# EAGLE design U23_2012 (EAGLE 6.3)
test

## Sheet 1 of 6: VGA
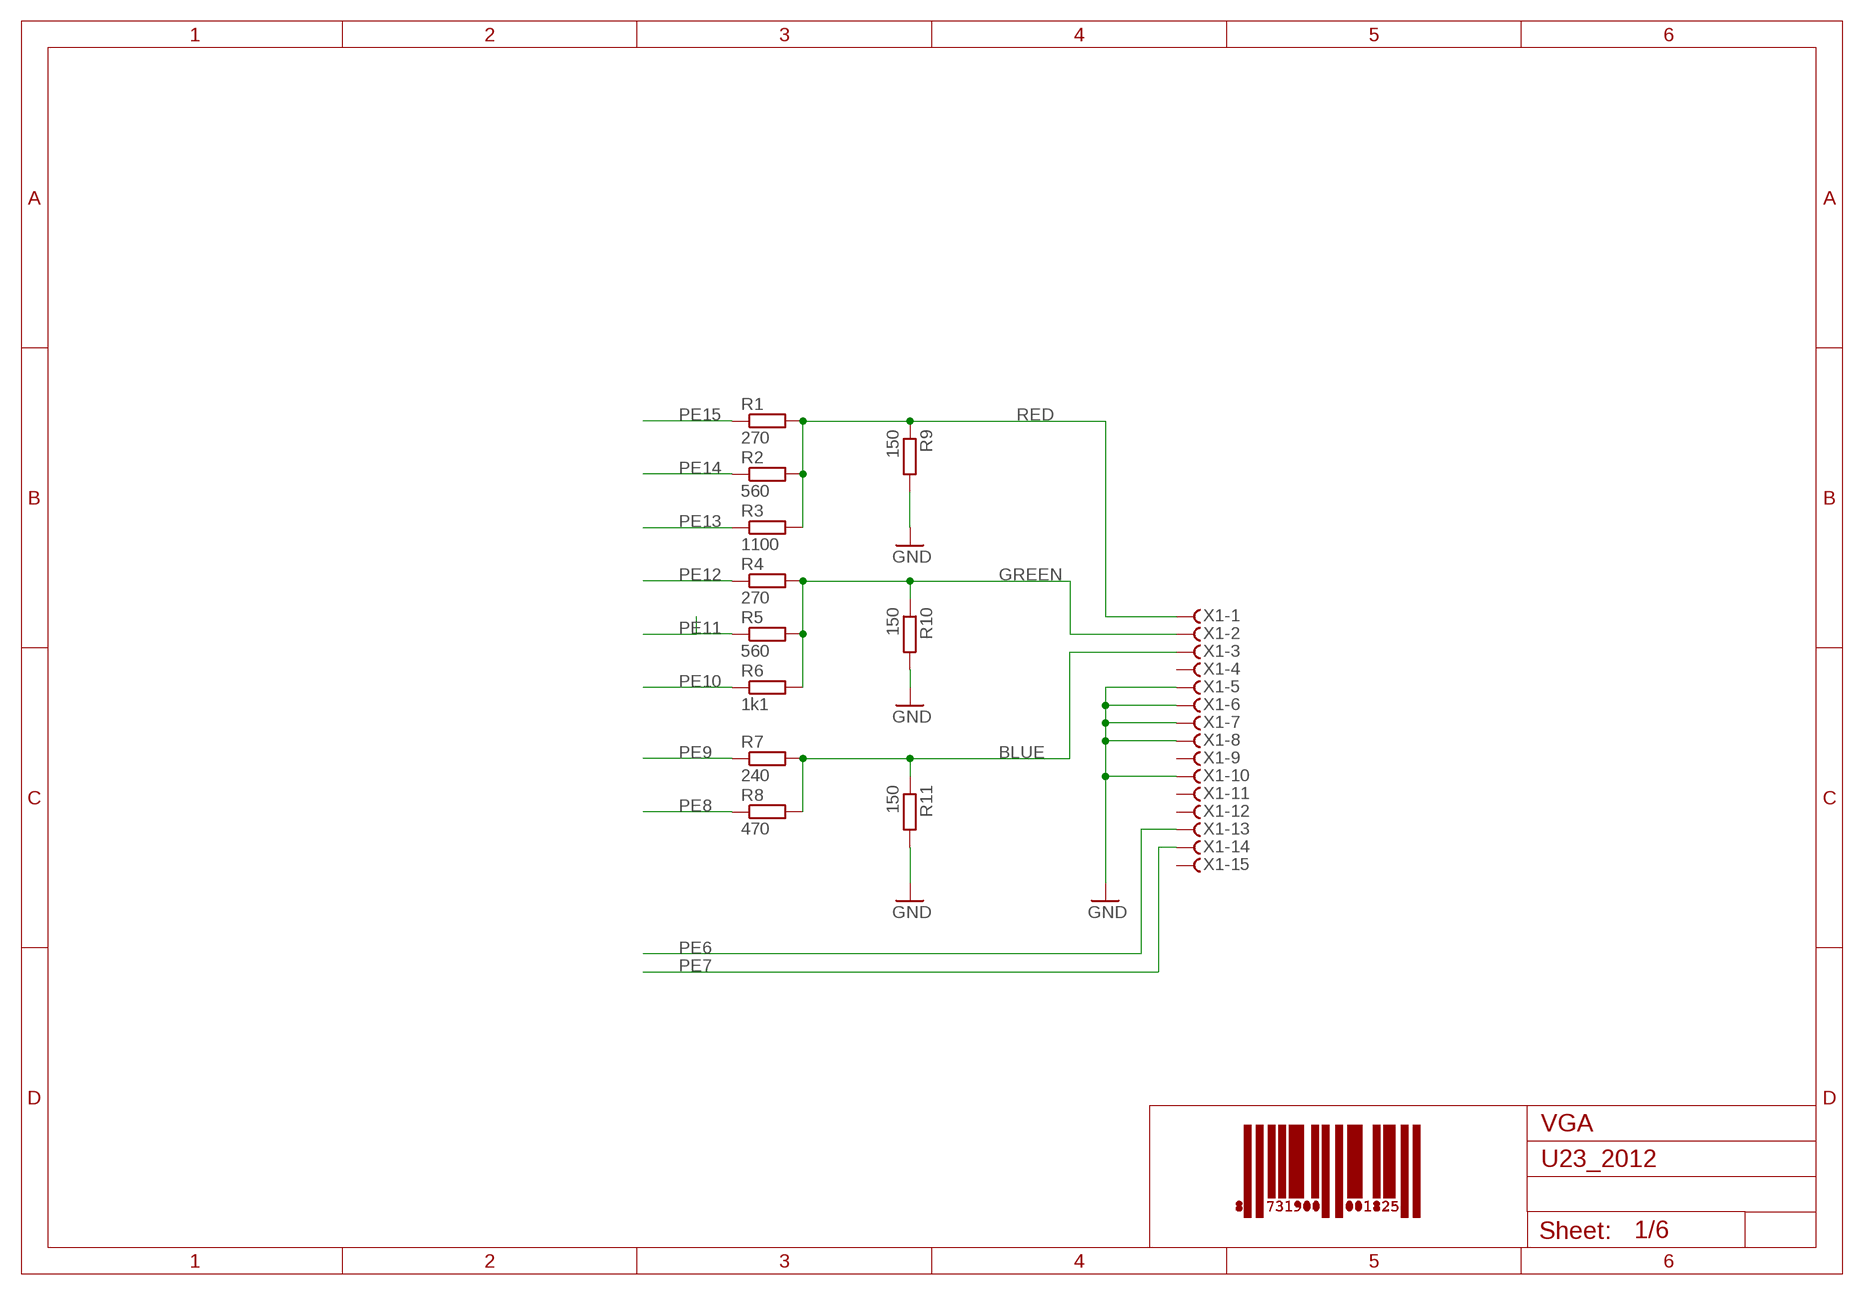
[diagram p0: schematic, sheet 1]

### Parts
R1  270  R-EU_0207/10  [0207/10]
R2  560  R-EU_0207/10  [0207/10]
R3  1100  R-EU_0207/10  [0207/10]
R4  270  R-EU_0207/10  [0207/10]
R5  560  R-EU_0207/10  [0207/10]
R6  1k1  R-EU_0207/10  [0207/10]
R7  240  R-EU_0207/10  [0207/10]
R8  470  R-EU_0207/10  [0207/10]
R9  150  R-EU_0207/10  [0207/10]
R10  150  R-EU_0207/10  [0207/10]
R11  150  R-EU_0207/10  [0207/10]
X1  F15HDHS  [HDF15H]

### Nets
BLUE: R7.2 R8.2 R11.1 X1.3
GND: R9.2 R10.2 R11.2 X1.5 X1.6 X1.7 X1.8 X1.10 ; also sheet 2,3,4,5,6
GREEN: R4.2 R5.2 R6.2 R10.1 X1.2
PE6: X1.13 ; also sheet 2
PE7: X1.14 ; also sheet 2
PE8: R8.1 ; also sheet 2
PE9: R7.1 ; also sheet 2
PE10: R6.1 ; also sheet 2
PE11: R5.1 ; also sheet 2
PE12: R4.1 ; also sheet 2
PE13: R3.1 ; also sheet 2
PE14: R2.1 ; also sheet 2
PE15: R1.1 ; also sheet 2
RED: R1.2 R2.2 R3.2 R9.1 X1.1
Unconnected: X1.4 X1.9 X1.11 X1.12 X1.15

## Sheet 2 of 6: Connector
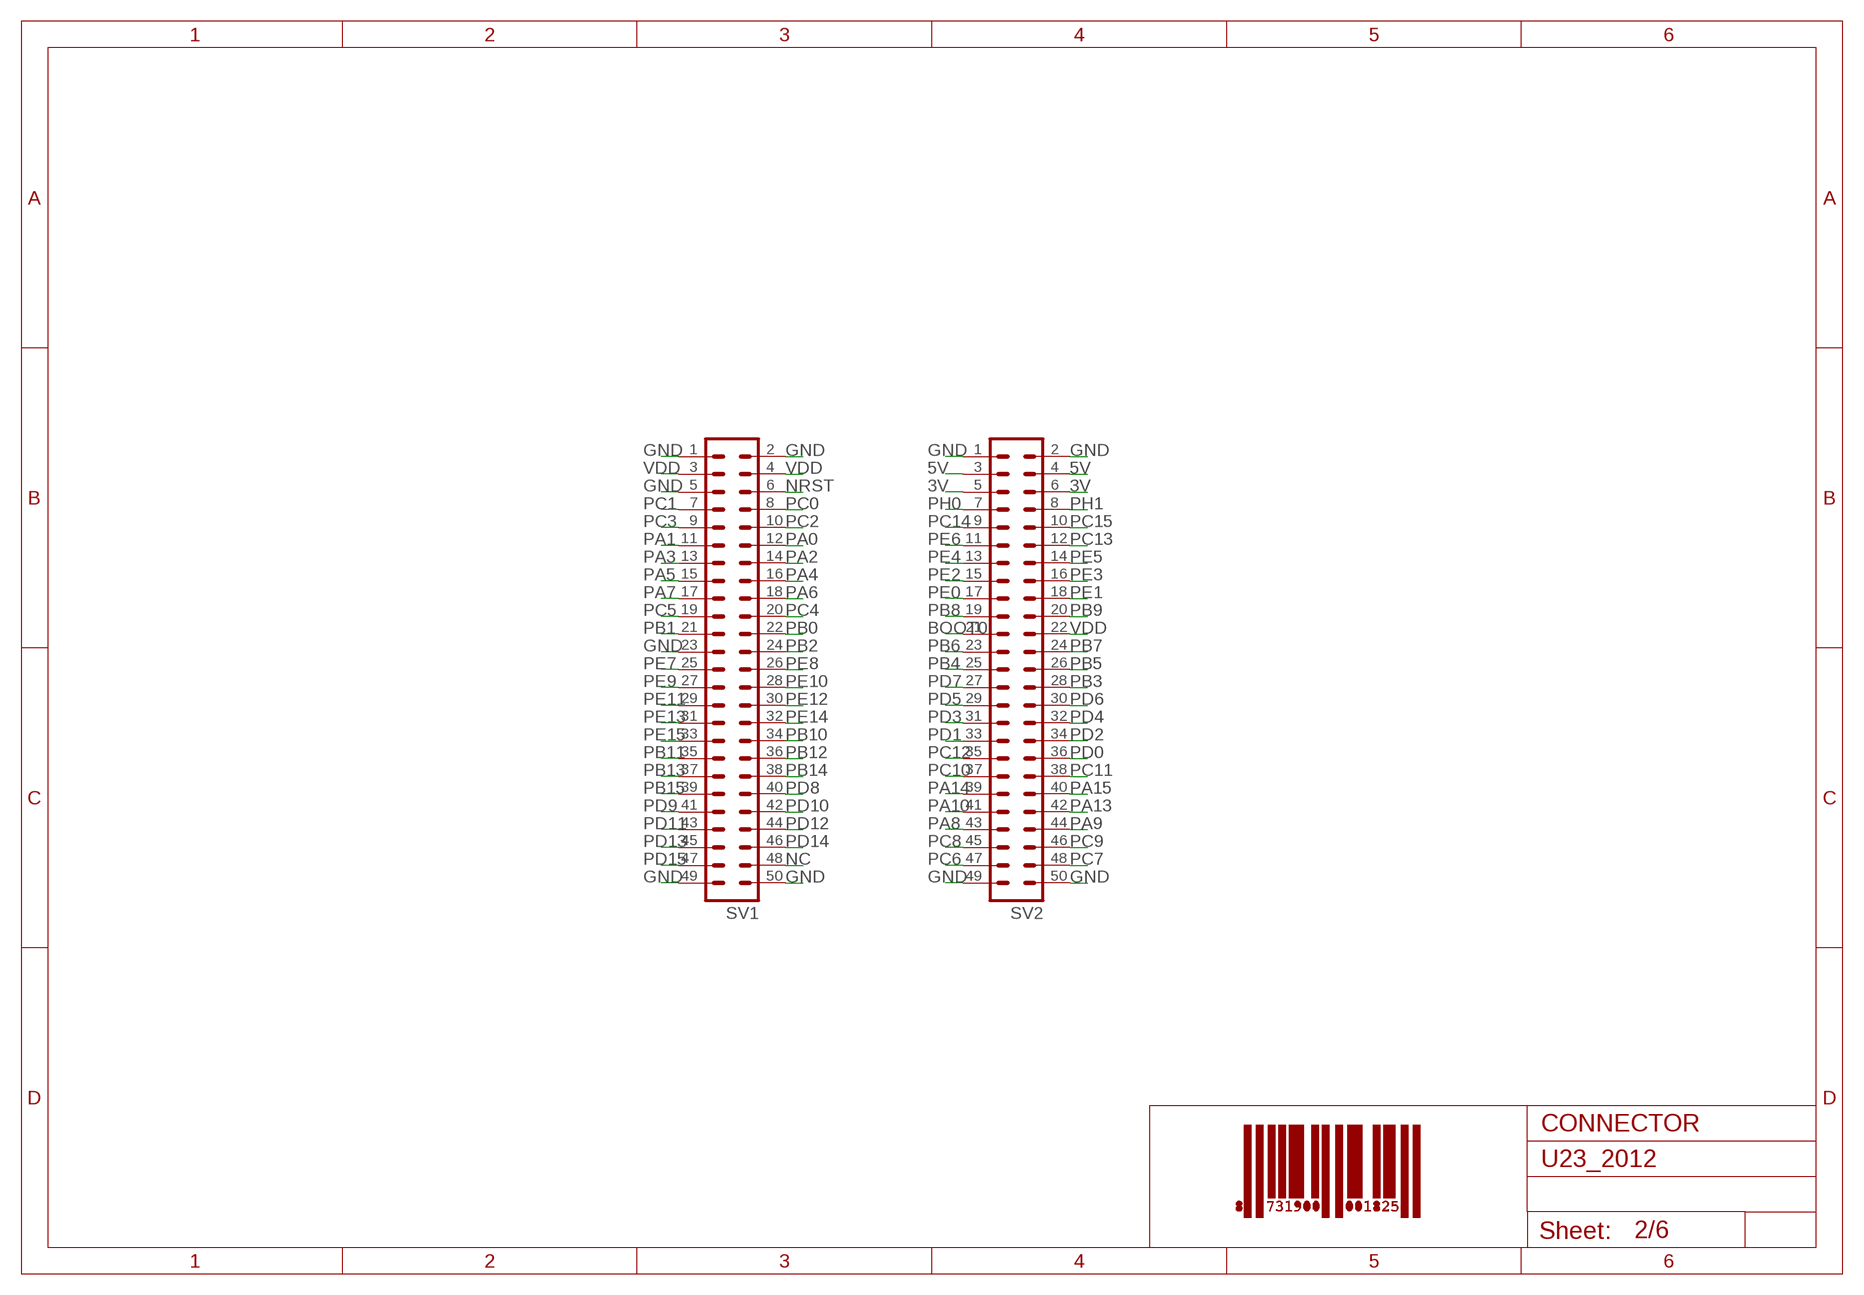
[diagram p1: schematic, sheet 2]

### Parts
SV1  ML50  [ML50]
SV2  ML50  [ML50]

### Nets
3V: SV2.5 SV2.6 ; also sheet 3,4,6
5V: SV2.3 SV2.4 ; also sheet 5,6
BOOT0: SV2.21
GND: SV1.1 SV1.2 SV1.5 SV1.23 SV1.49 SV1.50 SV2.1 SV2.2 SV2.49 SV2.50 ; also sheet 1,3,4,5,6
NC: SV1.48
NRST: SV1.6
PA0: SV1.12
PA1: SV1.11 ; also sheet 3
PA2: SV1.14 ; also sheet 3
PA3: SV1.13
PA4: SV1.16
PA5: SV1.15
PA6: SV1.18
PA7: SV1.17 ; also sheet 3
PA8: SV2.43
PA9: SV2.44
PA10: SV2.41
PA13: SV2.42
PA14: SV2.39
PA15: SV2.40
PB0: SV1.22 ; also sheet 6
PB1: SV1.21 ; also sheet 6
PB2: SV1.24 ; also sheet 4
PB3: SV2.28
PB4: SV2.25 ; also sheet 6
PB5: SV2.26 ; also sheet 6
PB6: SV2.23
PB7: SV2.24 ; also sheet 6
PB8: SV2.19 ; also sheet 6
PB9: SV2.20
PB10: SV1.34
PB11: SV1.35 ; also sheet 3
PB12: SV1.36 ; also sheet 3
PB13: SV1.37 ; also sheet 3
PB14: SV1.38
PB15: SV1.39
PC0: SV1.8
PC1: SV1.7 ; also sheet 3
PC2: SV1.10
PC3: SV1.9
PC4: SV1.20 ; also sheet 3
PC5: SV1.19 ; also sheet 3
PC6: SV2.47
PC7: SV2.48
PC8: SV2.45 ; also sheet 4
PC9: SV2.46 ; also sheet 4
PC10: SV2.37 ; also sheet 4
PC11: SV2.38 ; also sheet 4
PC12: SV2.35 ; also sheet 4
PC13: SV2.12
PC14: SV2.9
PC15: SV2.10
PD0: SV2.36 ; also sheet 5
PD1: SV2.33 ; also sheet 5
PD2: SV2.34 ; also sheet 4
PD3: SV2.31 ; also sheet 5
PD4: SV2.32
PD5: SV2.29 ; also sheet 5
PD6: SV2.30 ; also sheet 5
PD7: SV2.27 ; also sheet 5
PD8: SV1.40 ; also sheet 6
PD9: SV1.41
PD10: SV1.42
PD11: SV1.43
PD12: SV1.44 ; also sheet 6
PD13: SV1.45 ; also sheet 6
PD14: SV1.46 ; also sheet 6
PD15: SV1.47 ; also sheet 6
PE0: SV2.17
PE1: SV2.18
PE2: SV2.15
PE3: SV2.16
PE4: SV2.13
PE5: SV2.14
PE6: SV2.11 ; also sheet 1
PE7: SV1.25 ; also sheet 1
PE8: SV1.26 ; also sheet 1
PE9: SV1.27 ; also sheet 1
PE10: SV1.28 ; also sheet 1
PE11: SV1.29 ; also sheet 1
PE12: SV1.30 ; also sheet 1
PE13: SV1.31 ; also sheet 1
PE14: SV1.32 ; also sheet 1
PE15: SV1.33 ; also sheet 1
PH0: SV2.7
PH1: SV2.8
VDD: SV1.3 SV1.4 SV2.22

## Sheet 3 of 6: Ethernet
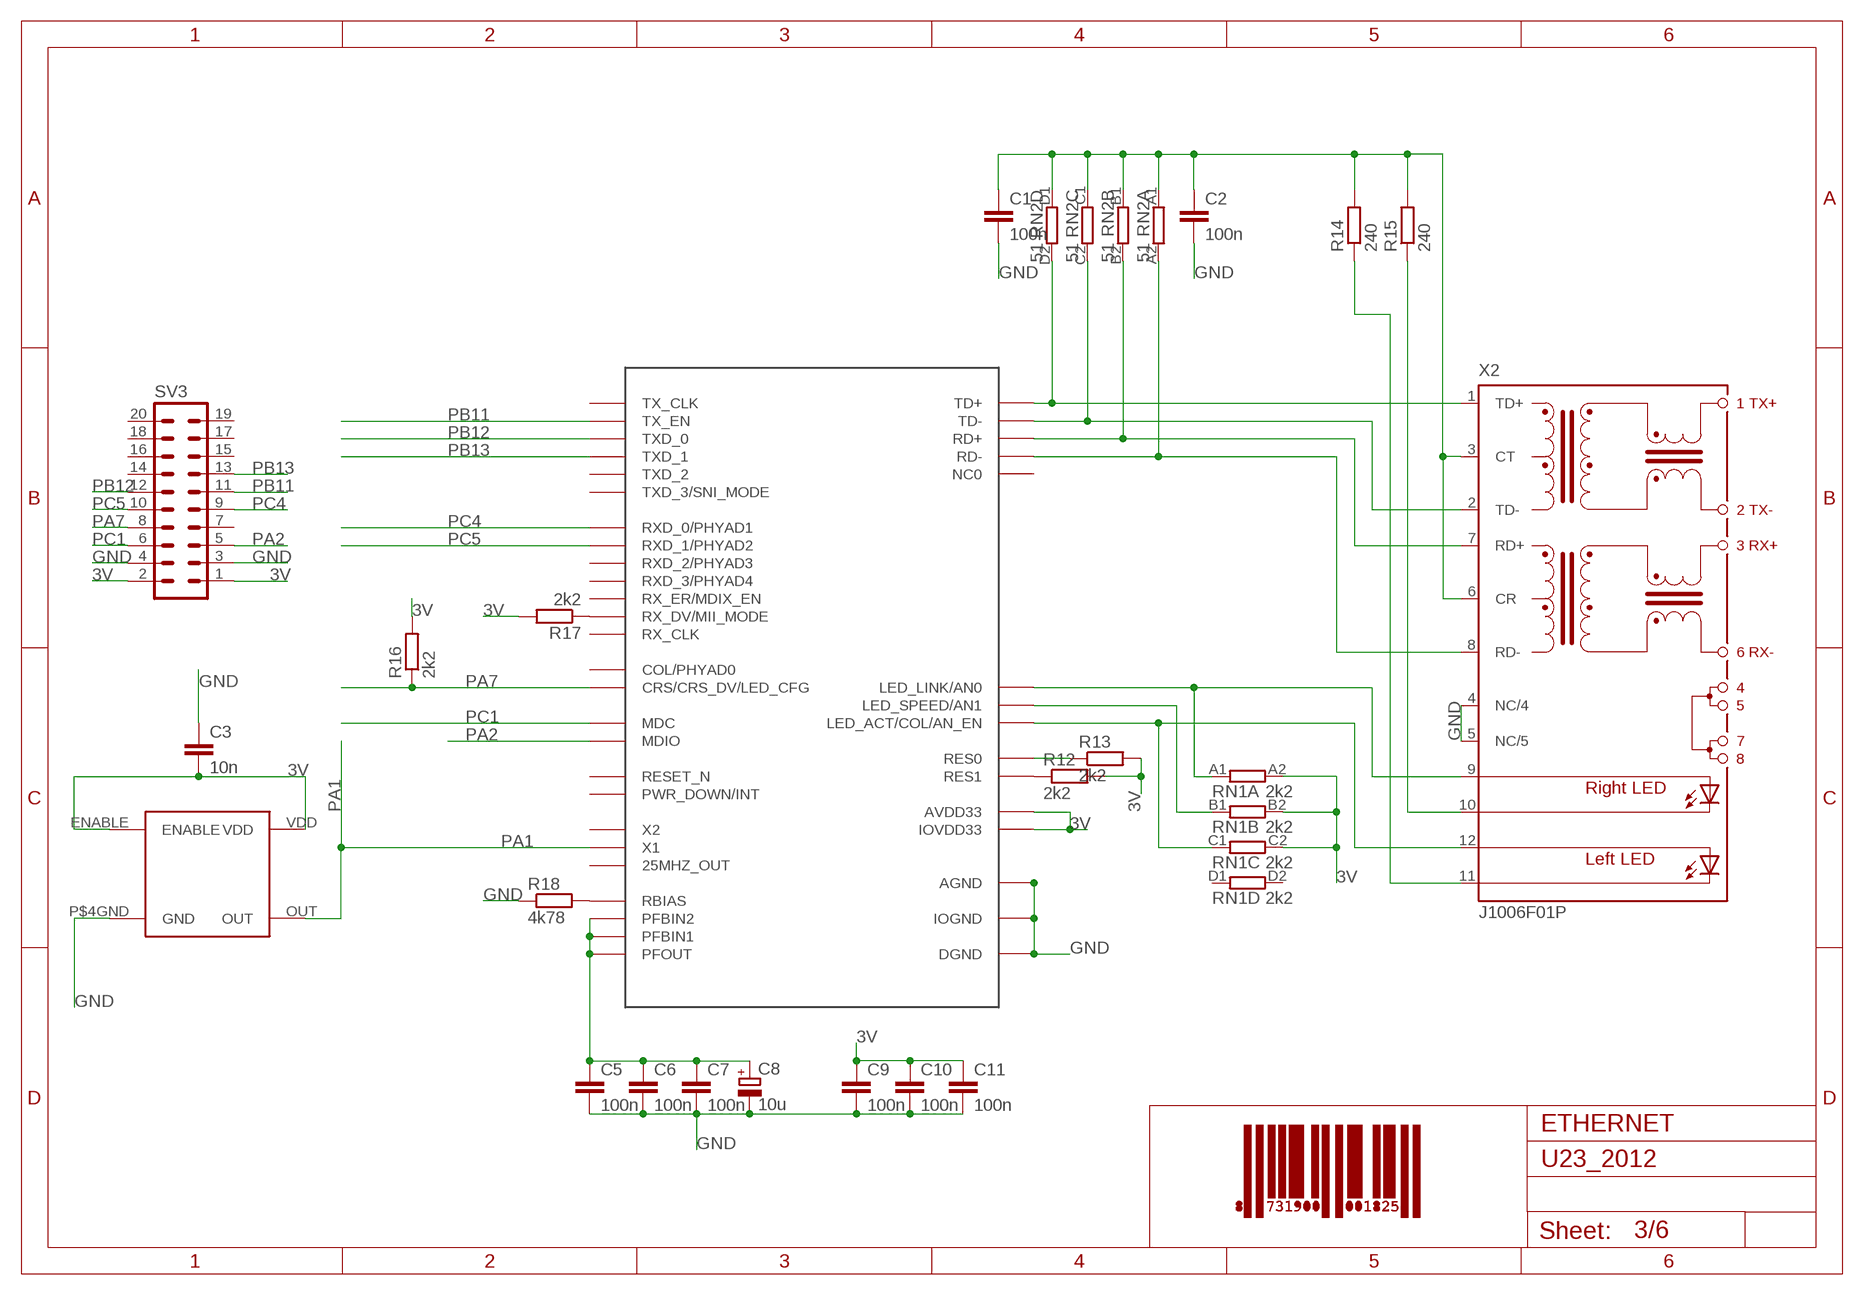
[diagram p2: schematic, sheet 3]

### Parts
C1  100n  C-EUC0603  [C0603]
C2  100n  C-EUC0603  [C0603]
C3  10n  C-EUC0603  [C0603]
C5  100n  C-EUC0603  [C0603]
C6  100n  C-EUC0603  [C0603]
C7  100n  C-EUC0603  [C0603]
C8  10u  CPOL-EUSMCC  [SMC_C]
C9  100n  C-EUC0603  [C0603]
C10  100n  C-EUC0603  [C0603]
C11  100n  C-EUC0603  [C0603]
R12  2k2  R-EU_R0603  [R0603]
R13  2k2  R-EU_R0603  [R0603]
R14  240  R-EU_R0603  [R0603]
R15  240  R-EU_R0603  [R0603]
R16  2k2  R-EU_R0603  [R0603]
R17  2k2  R-EU_R0603  [R0603]
R18  4k78  R-EU_R0603  [R0603]
RN1  2k2  4R-N  [CAR06ES]
RN2  51  4R-N  [CAR06ES]
SV3  ML20L  [ML20L]
U$1  DP83848CVV  [LQFP-44]
U$5  50Mhz  FXO_HC73  [FXO_HC73]
X2  J1006F01P  [J1]

### Nets
3V: C3.2 C9.1 C10.1 C11.1 R12.2 R13.2 R16.2 R17.2 RN1.A2 RN1.B2 RN1.C2 SV3.1 SV3.2 U$1.22(AVDD33) U$1.32(IOVDD33) U$1.48(IOVDD33) U$5.ENABLE U$5.VDD ; also sheet 2,4,6
GND: C1.2 C2.2 C3.1 C5.2 C6.2 C7.2 C8.- C9.2 C10.2 C11.2 R18.1 SV3.3 SV3.4 U$1.15(AGND) U$1.19(AGND) U$1.35(IOGND) U$1.36(DGND) U$1.47(IOGND) U$5.P$4GND(GND) X2.4(NC/4) X2.5(NC/5) ; also sheet 1,2,4,5,6
N$1: RN2.D2 U$1.17(TD+) X2.1(TD+)
N$2: RN2.C2 U$1.16(TD-) X2.2(TD-)
N$3: RN2.B2 U$1.14(RD+) X2.7(RD+)
N$4: RN2.A2 U$1.13(RD-) X2.8(RD-)
N$5: RN1.A1 U$1.28(LED_LINK/AN0) X2.9(A-R)
N$6: RN1.C1 U$1.26(LED_ACT/COL/AN_EN) X2.12(A-L)
N$7: RN1.B1 U$1.27(LED_SPEED/AN1)
N$8: R12.1 U$1.21(RES1)
N$9: R13.1 U$1.20(RES0)
N$10: C1.1 C2.1 R14.2 R15.2 RN2.A1 RN2.B1 RN2.C1 RN2.D1 X2.3(CT) X2.6(CR)
N$11: R17.1 U$1.39(RX_DV/MII_MODE)
N$12: R15.1 X2.10(C-R)
N$13: R14.1 X2.11(C-L)
N$23: R18.2 U$1.24(RBIAS)
N$24: C5.1 C6.1 C7.1 C8.+ U$1.18(PFBIN1) U$1.23(PFOUT) U$1.37(PFBIN2)
PA1: U$1.34(X1) U$5.OUT ; also sheet 2
PA2: SV3.5 U$1.30(MDIO) ; also sheet 2
PA7: R16.1 SV3.8 U$1.40(CRS/CRS_DV/LED_CFG) ; also sheet 2
PB11: SV3.11 U$1.2(TX_EN) ; also sheet 2
PB12: SV3.12 U$1.3(TXD_0) ; also sheet 2
PB13: SV3.13 U$1.4(TXD_1) ; also sheet 2
PC1: SV3.6 U$1.31(MDC) ; also sheet 2
PC4: SV3.9 U$1.43(RXD_0/PHYAD1) ; also sheet 2
PC5: SV3.10 U$1.44(RXD_1/PHYAD2) ; also sheet 2
Unconnected: RN1.D1 RN1.D2 SV3.7 SV3.14 SV3.15 SV3.16 SV3.17 SV3.18 SV3.19 SV3.20 U$1.1(TX_CLK) U$1.5(TXD_2) U$1.6(TXD_3/SNI_MODE) U$1.7(PWR_DOWN/INT) U$1.8(NC0) U$1.9(NC0) U$1.10(NC0) U$1.11(NC0) U$1.12(NC0) U$1.25(25MHZ_OUT) U$1.29(RESET_N) U$1.33(X2) U$1.38(RX_CLK) U$1.41(RX_ER/MDIX_EN) U$1.42(COL/PHYAD0) U$1.45(RXD_2/PHYAD3) U$1.46(RXD_3/PHYAD4)

## Sheet 4 of 6
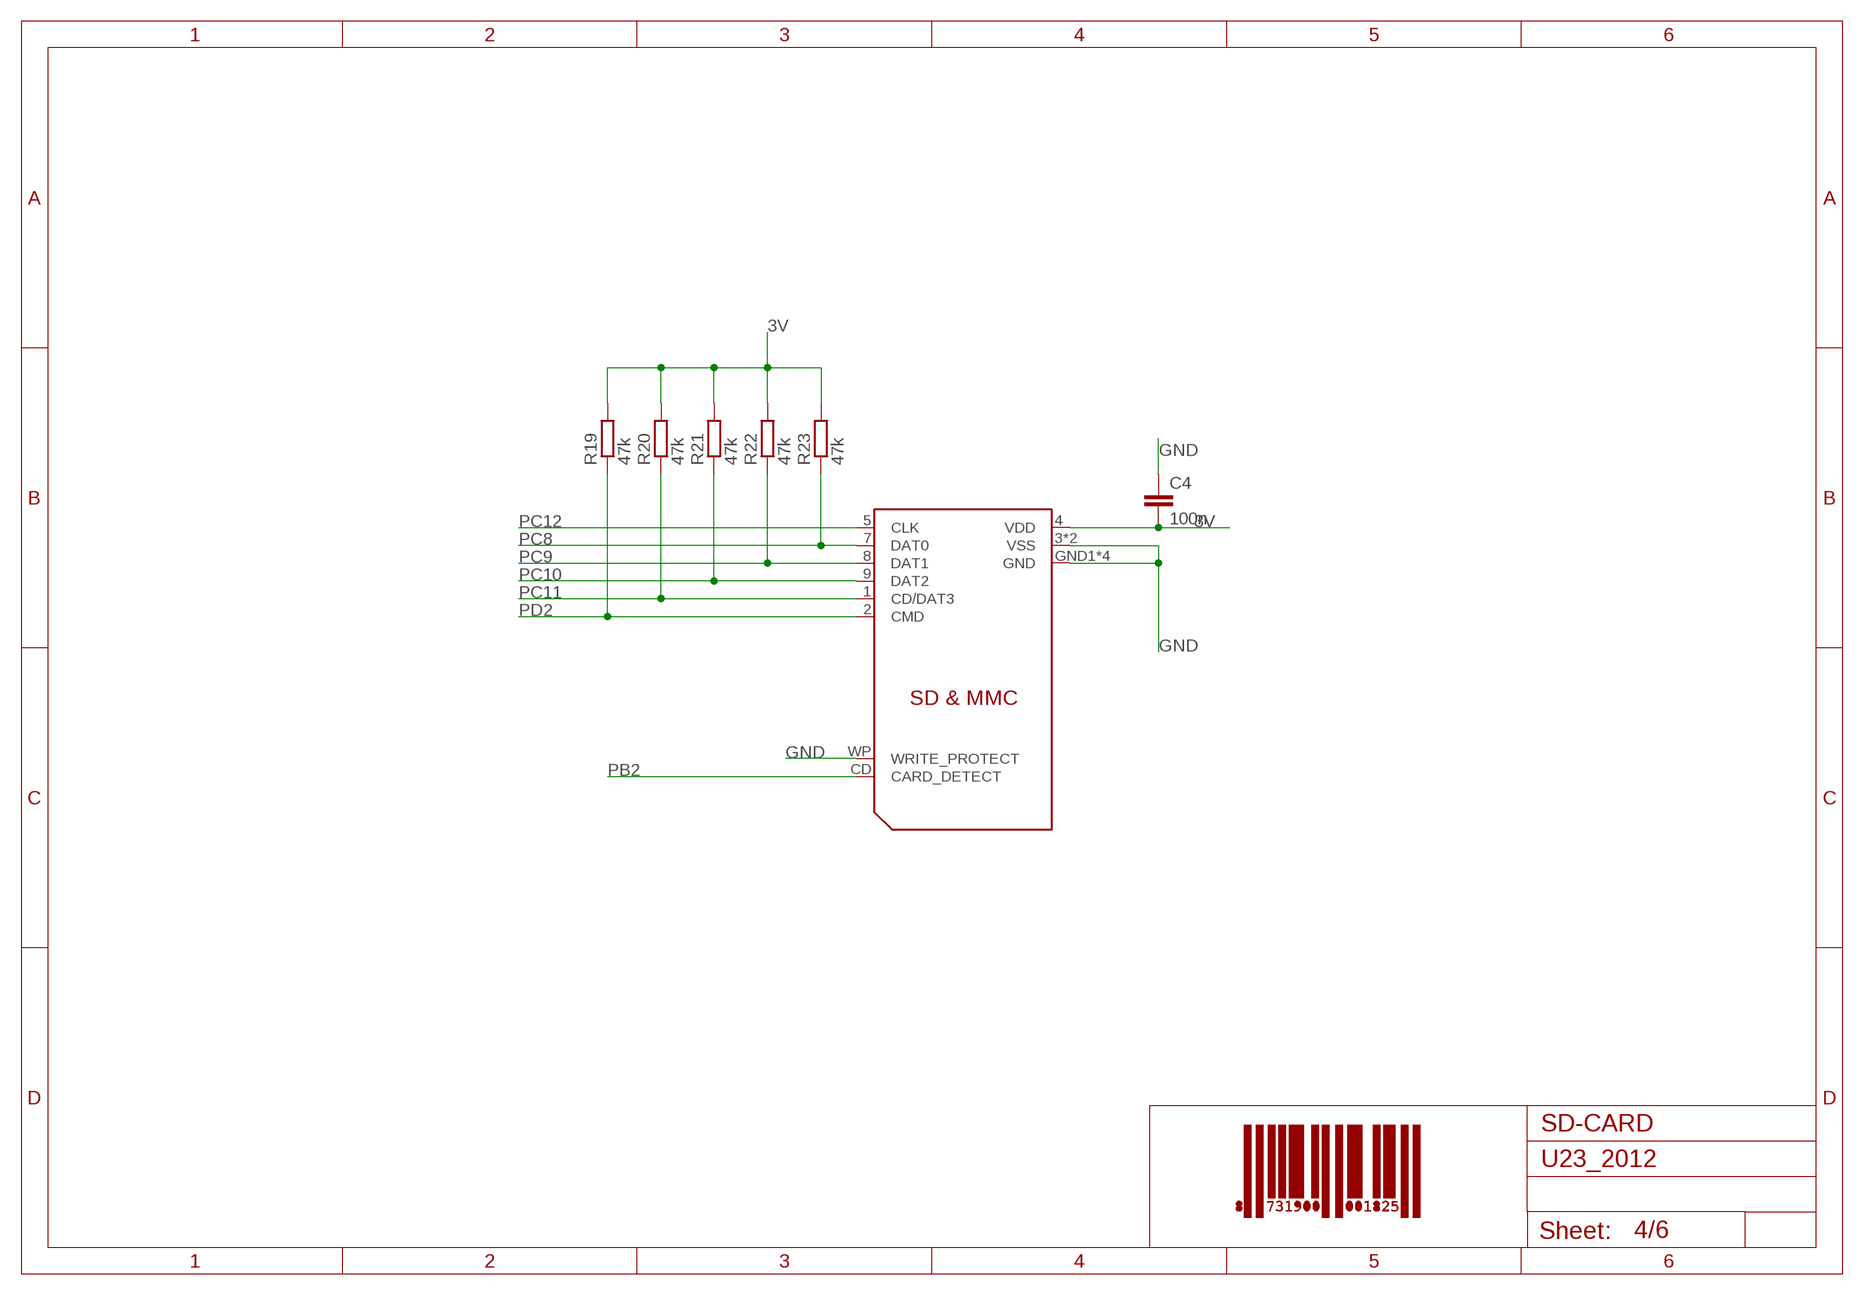
[diagram p3: schematic, sheet 4]

### Parts
C4  100n  C-EU025-024X044  [C025-024X044]
R19  47k  R-EU_0207/10  [0207/10]
R20  47k  R-EU_0207/10  [0207/10]
R21  47k  R-EU_0207/10  [0207/10]
R22  47k  R-EU_0207/10  [0207/10]
R23  47k  R-EU_0207/10  [0207/10]
U$2  SD-CARD  [SD_CARD]

### Nets
3V: C4.2 R19.2 R20.2 R21.2 R22.2 R23.2 U$2.4(VDD) ; also sheet 2,3,6
GND: C4.1 U$2.3(VSS) U$2.6(VSS) U$2.GND1(GND) U$2.GND2(GND) U$2.SHIELD1(GND) U$2.SHIELD2(GND) U$2.WP(WRITE_PROTECT) ; also sheet 1,2,3,5,6
PB2: U$2.CD(CARD_DETECT) ; also sheet 2
PC8: R23.1 U$2.7(DAT0) ; also sheet 2
PC9: R22.1 U$2.8(DAT1) ; also sheet 2
PC10: R21.1 U$2.9(DAT2) ; also sheet 2
PC11: R20.1 U$2.1(CD/DAT3) ; also sheet 2
PC12: U$2.5(CLK) ; also sheet 2
PD2: R19.1 U$2.2(CMD) ; also sheet 2

## Sheet 5 of 6
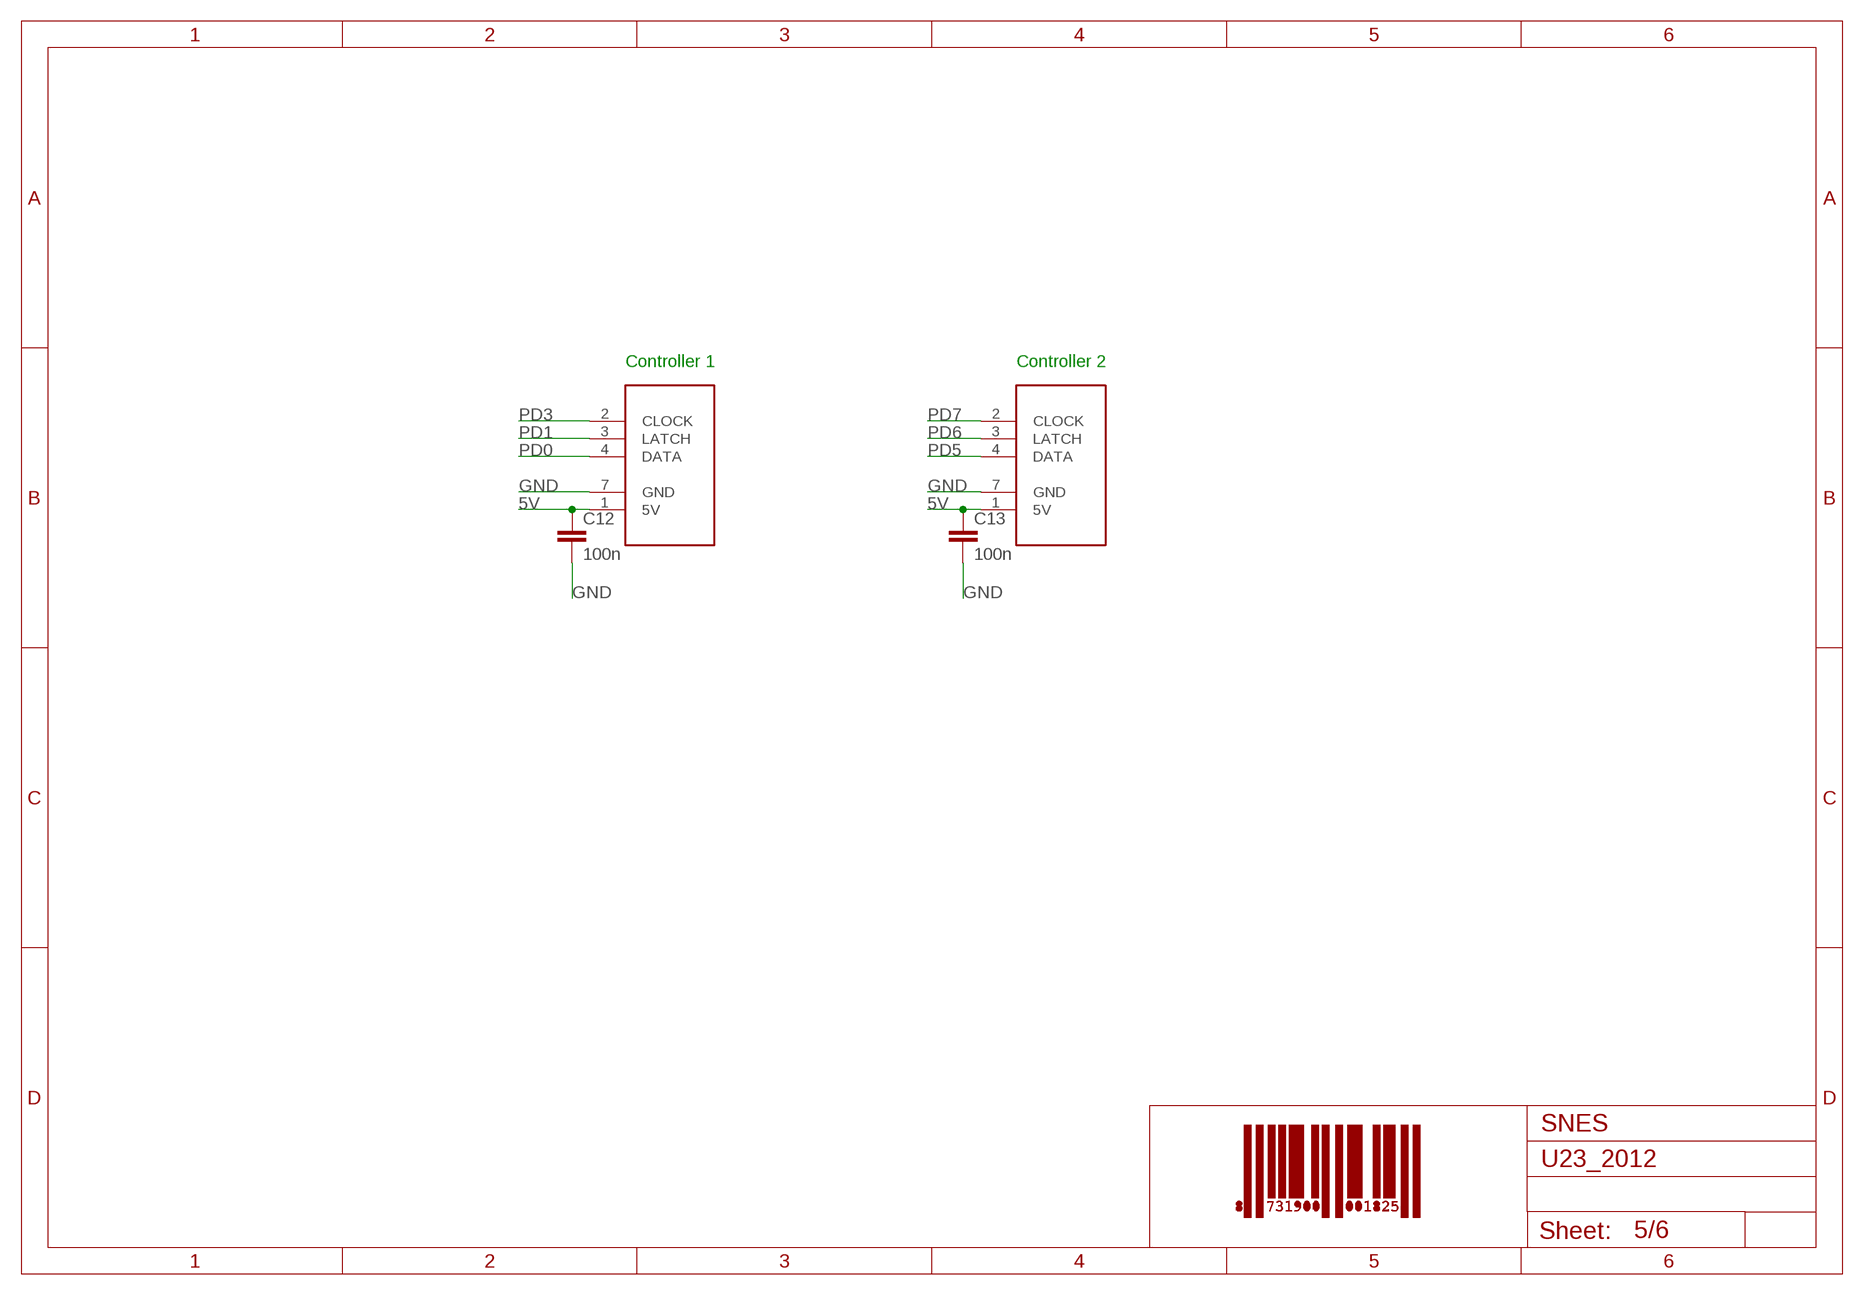
[diagram p4: schematic, sheet 5]

### Parts
C12  100n  C-EU025-024X044  [C025-024X044]
C13  100n  C-EU025-024X044  [C025-024X044]
U$3  SNES  [SNES]
U$4  SNES  [SNES]

### Nets
5V: C12.1 C13.1 U$3.1(5V) U$4.1(5V) ; also sheet 2,6
GND: C12.2 C13.2 U$3.7(GND) U$4.7(GND) ; also sheet 1,2,3,4,6
PD0: U$3.4(DATA) ; also sheet 2
PD1: U$3.3(LATCH) ; also sheet 2
PD3: U$3.2(CLOCK) ; also sheet 2
PD5: U$4.4(DATA) ; also sheet 2
PD6: U$4.3(LATCH) ; also sheet 2
PD7: U$4.2(CLOCK) ; also sheet 2

### Notes on the sheet
- Controller 1 | Controller 2

## Sheet 6 of 6
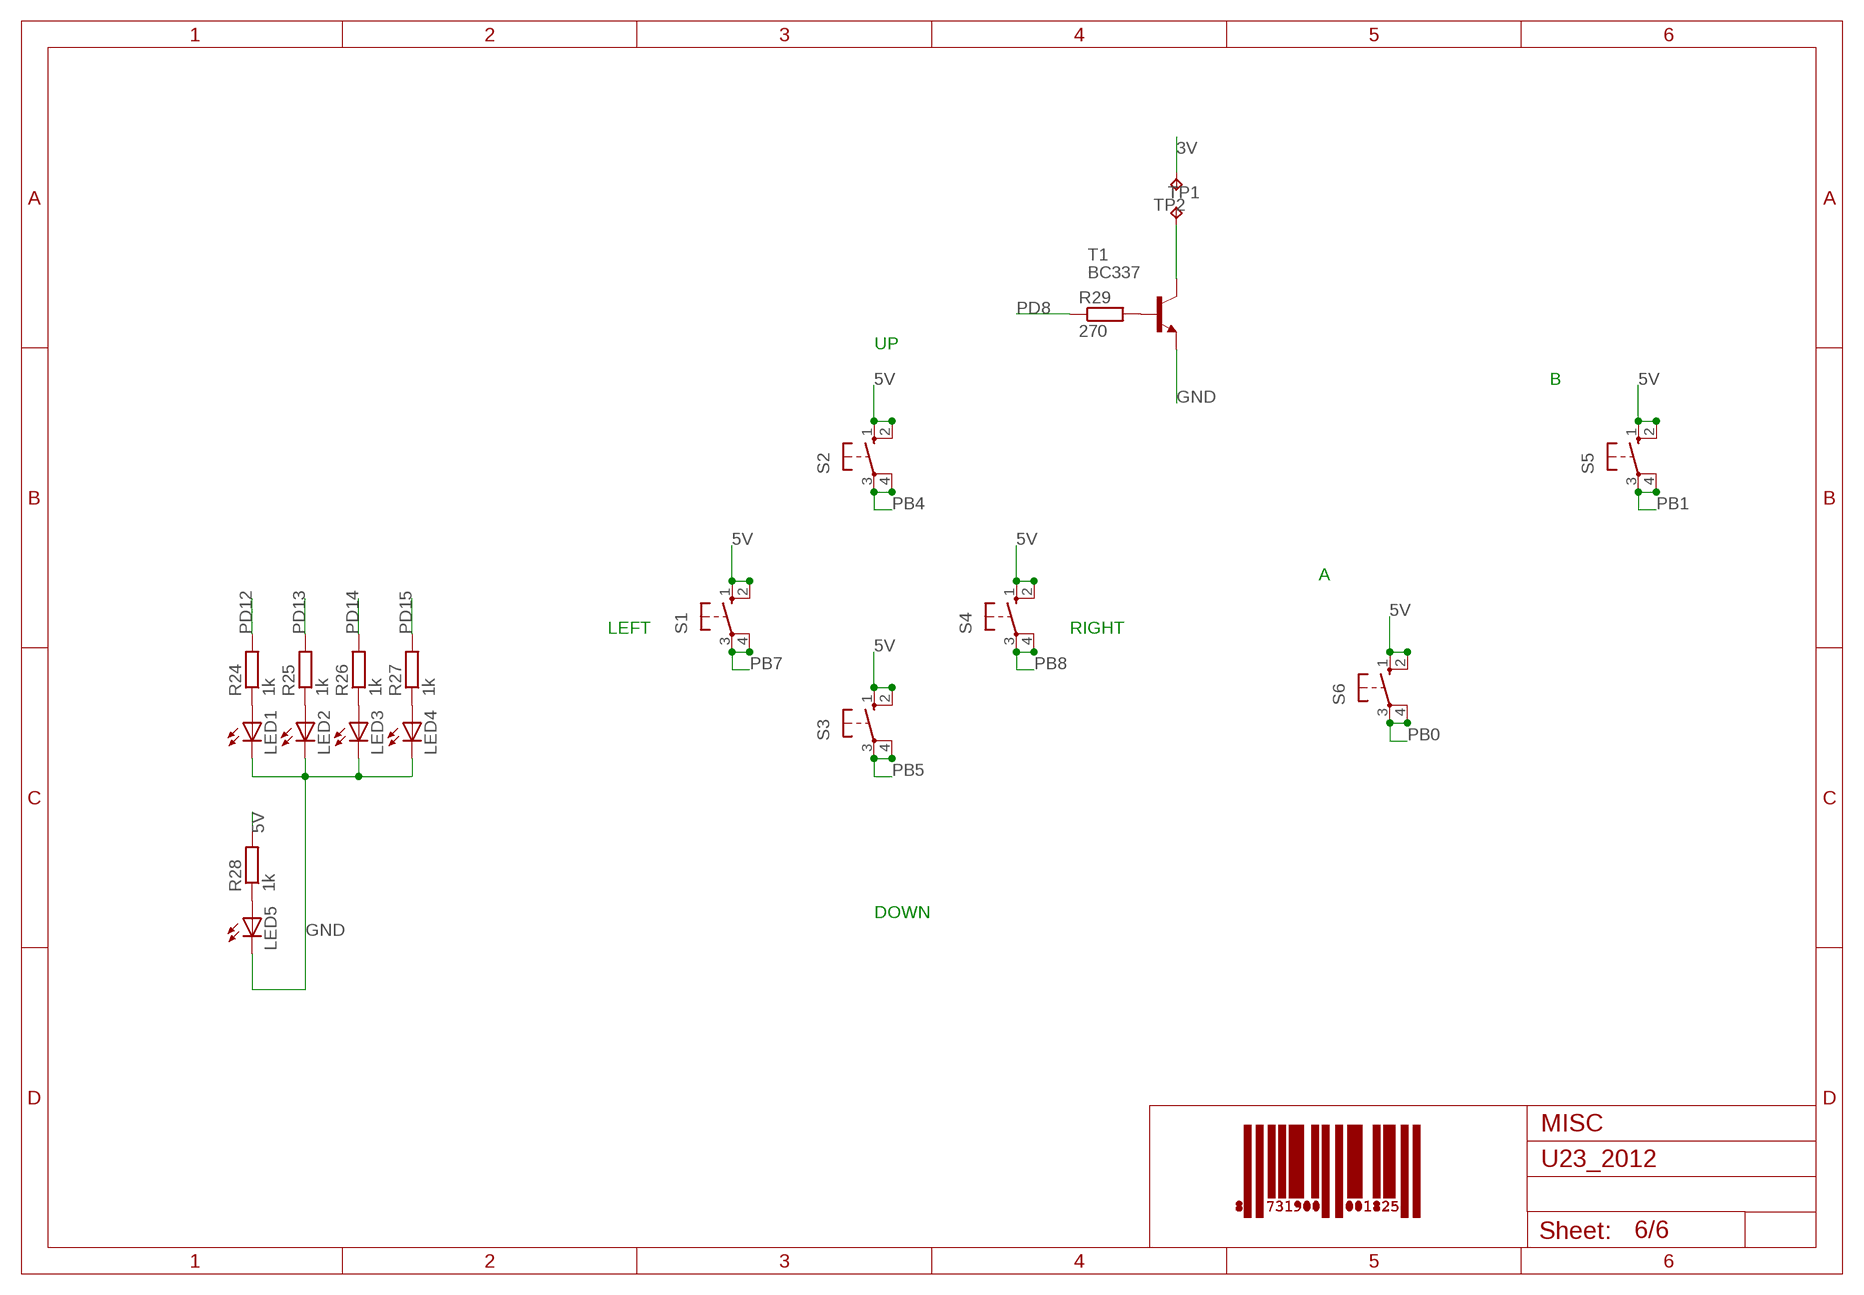
[diagram p5: schematic, sheet 6]

### Parts
LED1  LED3MM  [LED3MM]
LED2  LED3MM  [LED3MM]
LED3  LED3MM  [LED3MM]
LED4  LED3MM  [LED3MM]
LED5  LED3MM  [LED3MM]
R24  1k  R-EU_0207/10  [0207/10]
R25  1k  R-EU_0207/10  [0207/10]
R26  1k  R-EU_0207/10  [0207/10]
R27  1k  R-EU_0207/10  [0207/10]
R28  1k  R-EU_0207/10  [0207/10]
R29  270  R-EU_0207/10  [0207/10]
S1  10-XX  [B3F-10XX]
S2  10-XX  [B3F-10XX]
S3  10-XX  [B3F-10XX]
S4  10-XX  [B3F-10XX]
S5  10-XX  [B3F-10XX]
S6  10-XX  [B3F-10XX]
T1  BC337  [TO92]
TP1  TPTP20SQ  [TP20SQ]
TP2  TPTP20SQ  [TP20SQ]

### Nets
3V: TP2.TP ; also sheet 2,3,4
5V: R28.2 S1.1(S) S1.2(S1) S2.1(S) S2.2(S1) S3.1(S) S3.2(S1) S4.1(S) S4.2(S1) S5.1(S) S5.2(S1) S6.1(S) S6.2(S1) ; also sheet 2,5
GND: LED1.K(C) LED2.K(C) LED3.K(C) LED4.K(C) LED5.K(C) T1.1(E) ; also sheet 1,2,3,4,5
N$14: LED1.A R24.1
N$15: LED2.A R25.1
N$16: LED3.A R26.1
N$17: LED4.A R27.1
N$18: LED5.A R28.1
N$19: R29.2 T1.2(B)
N$20: T1.3(C) TP1.TP
PB0: S6.3(P) S6.4(P1) ; also sheet 2
PB1: S5.3(P) S5.4(P1) ; also sheet 2
PB4: S2.3(P) S2.4(P1) ; also sheet 2
PB5: S3.3(P) S3.4(P1) ; also sheet 2
PB7: S1.3(P) S1.4(P1) ; also sheet 2
PB8: S4.3(P) S4.4(P1) ; also sheet 2
PD8: R29.1 ; also sheet 2
PD12: R24.2 ; also sheet 2
PD13: R25.2 ; also sheet 2
PD14: R26.2 ; also sheet 2
PD15: R27.2 ; also sheet 2

### Notes on the sheet
- UP
- B
- A
- LEFT | RIGHT
- DOWN

## Library data of the parts
C1 C2 = resistor:C-EU: CAPACITOR, European symbol
C3-C7 C9-C13 = rcl:C-EU: CAPACITOR, European symbol
C8 = rcl:CPOL-EU: POLARIZED CAPACITOR, European symbol
LED1-LED5 = led:LED: LED OSRAM: - CHIPLED LG R971, LG N971, LY N971, LG Q971, LY Q971, LO R971, LY R971 LH N974, LH R974 LS Q976, LO Q976, LY Q976 LO Q996 - Hyper CHIPLED LW Q18S LB Q993, LB Q99A, LB R99A - SideLED LS A670, LO A670, LY A670, LG A670, LP A670 LB A673, LV A673, LT A673, LW A673 LH A674 LY A675 LS A676, LA A676, LO A676, LY A676, LW A676 LS A679, LY A679, LG A679 - Hyper Micro SIDELED® LS Y876, LA Y876, LO Y876, LY Y876 LT Y87S - SmartLED LW L88C, LW L88S LB L89C, LB L89S, LG L890 LS L89K, LO L89K, LY L89K LS L896, LA L896, LO L896, LY L896 - TOPLED LS T670, LO T670, LY T670, LG T670, LP T670 LSG T670, LSP T670, LSY T670, LOP T670, LYG T670 LG T671, LOG T671, LSG T671 LB T673, LV T673, LT T673, LW T673 LH T674 LS T676, LA T676, LO T676, LY T676, LB T676, LH T676, LSB T676, LW T676 LB T67C, LV T67C, LT T67C, LS T67K, LO T67K, LY T67K, LW E67C LS E67B, LA E67B, LO E67B, LY E67B, LB E67C, LV E67C, LT E67C LW T67C LS T679, LY T679, LG T679 LS T770, LO T770, LY T770, LG T770, LP T770 LB T773, LV T773, LT T773, LW T773 LH T774 LS E675, LA E675, LY E675, LS T675 LS T776, LA T776, LO T776, LY T776, LB T776 LHGB T686 LT T68C, LB T68C - Hyper Mini TOPLED® LB M676 - Mini TOPLED Santana® LG M470 LS M47K, LO M47K, LY M47K Source: http://www.osram.convergy.de LUXEON: - LUMILED® LXK2-PW12-R00, LXK2-PW12-S00, LXK2-PW14-U00, LXK2-PW14-V00 LXK2-PM12-R00, LXK2-PM12-S00, LXK2-PM14-U00 LXK2-PE12-Q00, LXK2-PE12-R00, LXK2-PE12-S00, LXK2-PE14-T00, LXK2-PE14-U00 LXK2-PB12-K00, LXK2-PB12-L00, LXK2-PB12-M00, LXK2-PB14-N00, LXK2-PB14-P00, LXK2-PB14-Q00 LXK2-PR12-L00, LXK2-PR12-M00, LXK2-PR14-Q00, LXK2-PR14-R00 LXK2-PD12-Q00, LXK2-PD12-R00, LXK2-PD12-S00 LXK2-PH12-R00, LXK2-PH12-S00 LXK2-PL12-P00, LXK2-PL12-Q00, LXK2-PL12-R00 Source: www.luxeon.com KINGBRIGHT: KA-3528ASYC Source: www.kingbright.com
R1-R11 R18-R29 = rcl:R-EU_: RESISTOR, European symbol
R12-R17 = resistor:R-EU_: RESISTOR, European symbol
RN1 RN2 = resistor-dil:4R-N: Array Chip Resistor Source: RS Component / Phycomp
S1-S6 = switch-omron:10-XX: OMRON SWITCH; MPN: B3F-1000; OC_FARNELL: 176432; OC_NEWARK: 36M3542
SV1 SV2 = con-ml:ML50: HARTING; OC_FARNELL: unknown; OC_NEWARK: unknown
SV3 = con-harting-ml:ML20: HARTING; OC_FARNELL: unknown; OC_NEWARK: unknown
T1 = transistor:BC337: NPN TRANSISTOR
TP1 TP2 = testpad:TP: Test pad
U$1 = library:DP83848CVV
U$2 = library:SD-CARD
U$3 U$4 = library:SNES
U$5 = library:FXO_HC73
X1 = con-subd:F15?S: SUB-D; OC_FARNELL: unknown; OC_NEWARK: unknown
X2 = con-pulse:J1006F01P: PULSEJACK (TM) 1x1 Tab-UP RJ45 10/100 Base-TX RJ45 1x1 Tab-UP with LEDs 8-pin (J1 series) and 6-pin (JP series) integrated magnetics connector, designed to support applications, such as ADSL modems, LAN-on-Motherboard, and Hub and Switches. Source: www.pulseeng.com .. PulseJack-J402.pdf; OC_FARNELL: unknown; OC_NEWARK: unknown

## Board
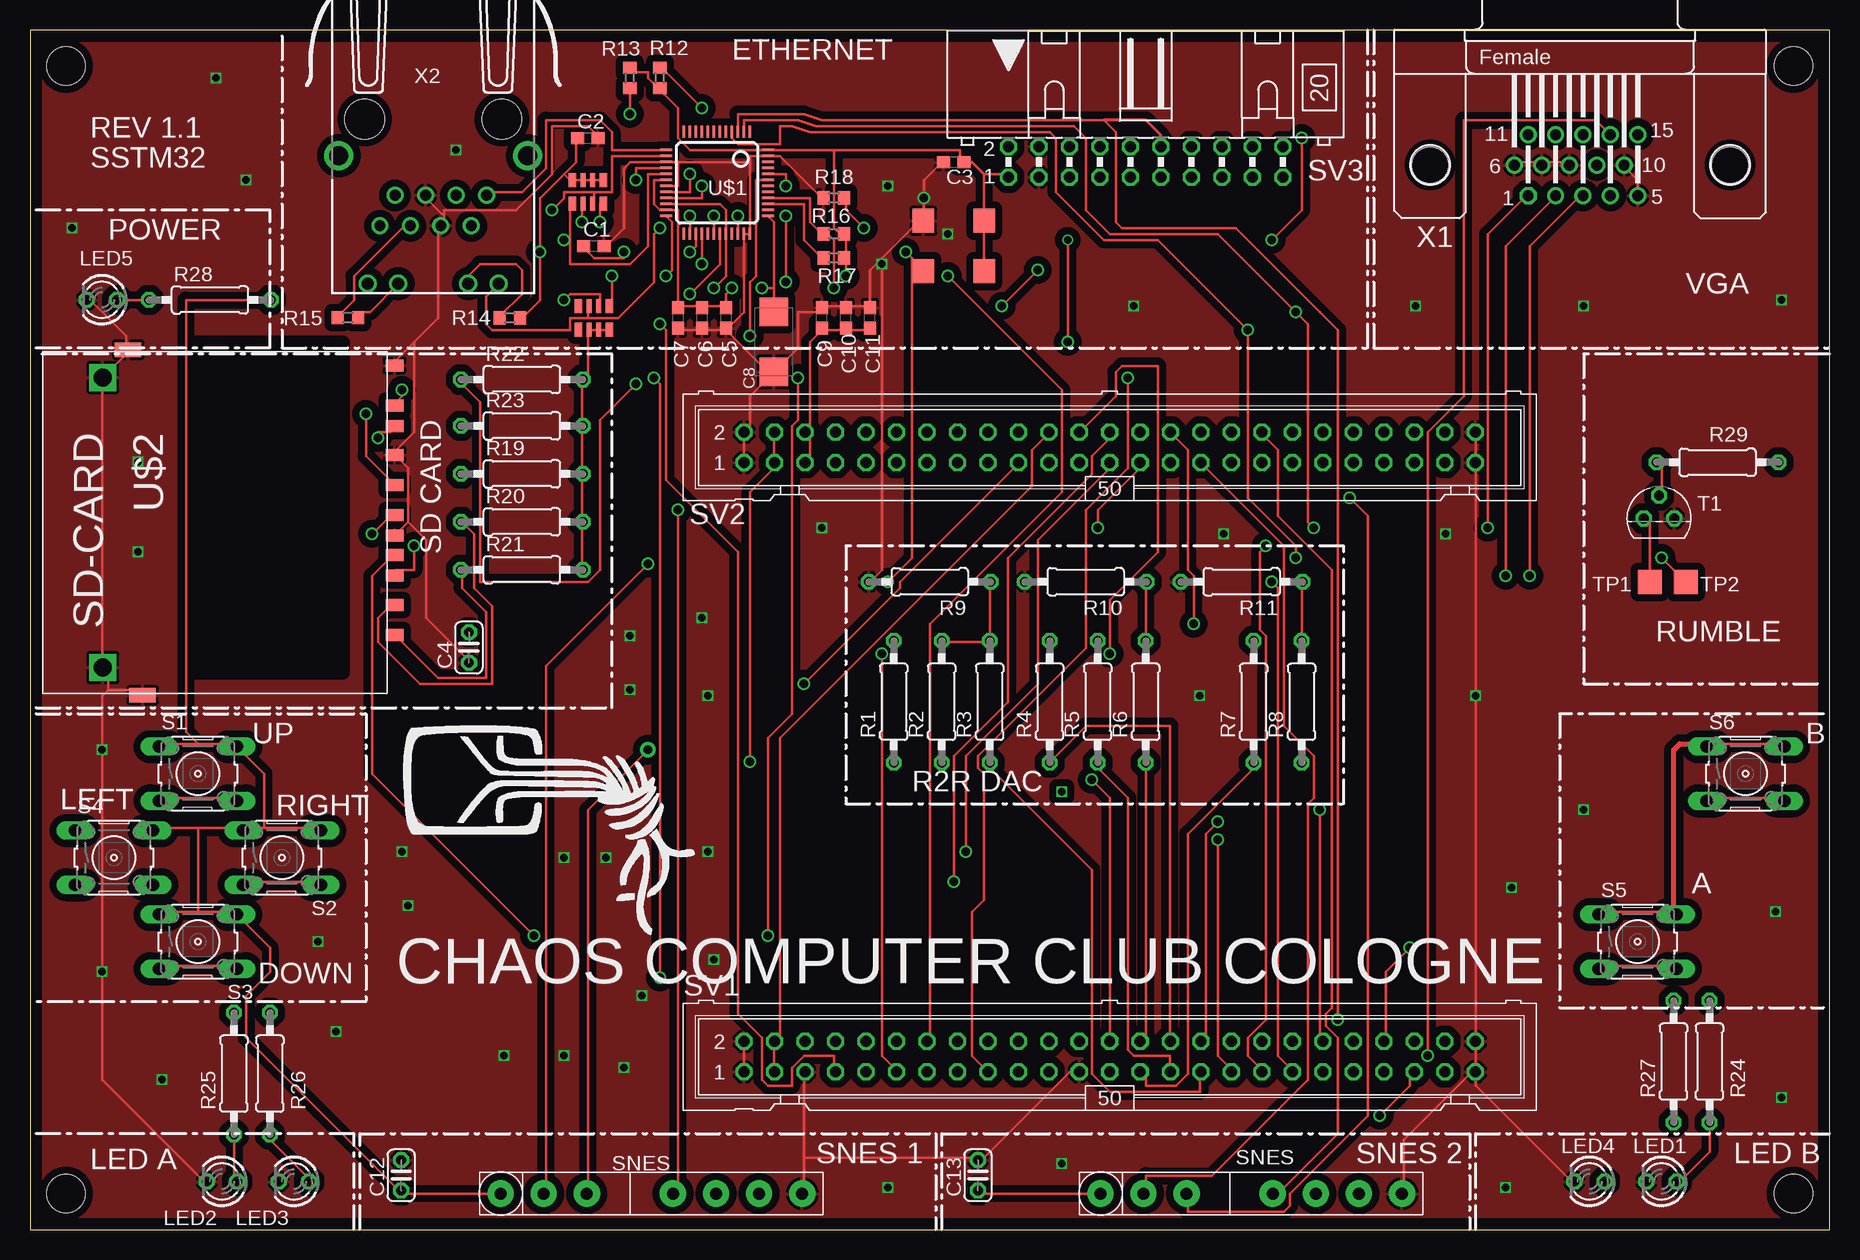
[diagram p6: board, top side]
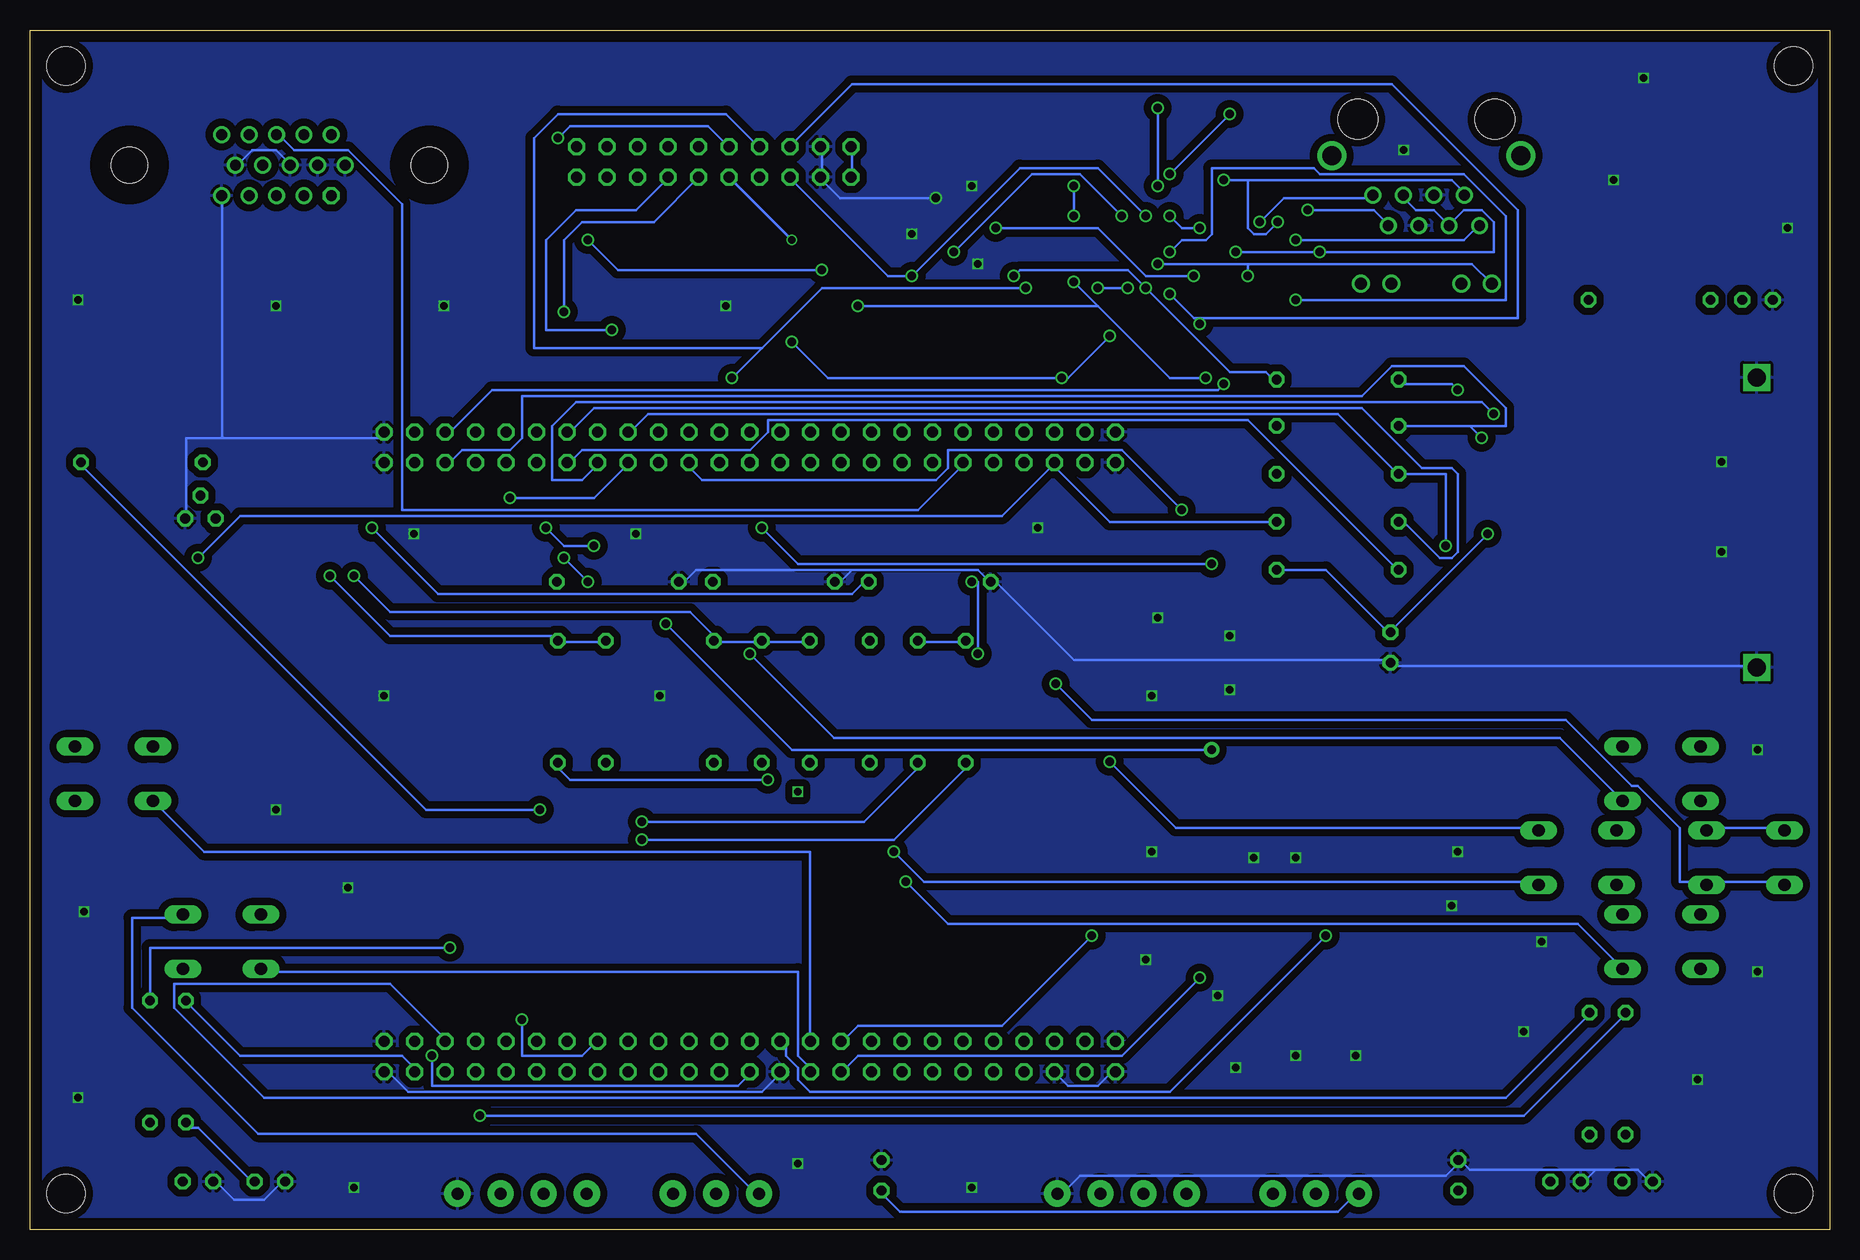
[diagram p7: board, bottom side, seen from below]

Size 150 x 100 mm. Coordinates in mm from the lower left corner, seen from the top.
Outline: 0,0 150,0 150,100 0,100 0,0
Copper layers (1*16): Top 0.035mm / dielectric 1.5mm / Bottom 0.035mm
Design rules "default": minimum track width 6mil, minimum drill 12mil, track to track 6mil, track to pad 6mil, pad to pad 6mil, via to via 6mil, smd to smd 0mil, copper to edge 10mil, drill to drill 10mil, minimum pad ring 10mil, minimum via ring 6mil, stop-mask expansion 2mil, vias tented up to drill 100mil, thermal gap 10mil
Holes 3.2 mm at 3,3 3,97 147,97 147,3
tKeepout: area 4.5,88 to 18.5,93

### Footprints (pad centres in the part's own frame; a part is rotated, then mirrored left to right if it is on the bottom)
C0603 = smd 1.1 x 1: 1 -0.85,0; 2 0.85,0
C025-024X044 = drill 0.813 octagon: 1 -1.27,0; 2 1.27,0
SMC_C = smd 2.4 x 2.4: + -2.5,0; - 2.5,0
LED3MM = drill 0.813 octagon: A -1.27,0; K 1.27,0
0207/10 = drill 0.813 octagon: 1 -5.08,0; 2 5.08,0
R0603 = smd 1 x 1.1: 1 -0.85,0; 2 0.85,0
CAR06ES = smd 0.63 x 1.15: A1 -1.295,-0.975; A2 -1.295,0.975; D1 1.295,-0.975; D2 1.295,0.975 | smd 0.44 x 1.15: B1 -0.4,-0.975; B2 -0.4,0.975; C1 0.4,-0.975; C2 0.4,0.975
B3F-10XX = drill 1.016 long: 1 -3.251,2.261; 2 3.251,2.261; 3 -3.251,-2.261; 4 3.251,-2.261
ML50 = drill 0.914 octagon: 1 -30.48,-1.27; 2 -30.48,1.27; 3 -27.94,-1.27; 4 -27.94,1.27; 5 -25.4,-1.27; 6 -25.4,1.27; 7 -22.86,-1.27; 8 -22.86,1.27; 9 -20.32,-1.27; 10 -20.32,1.27; 11 -17.78,-1.27; 12 -17.78,1.27; 13 -15.24,-1.27; 14 -15.24,1.27; 15 -12.7,-1.27; 16 -12.7,1.27; 17 -10.16,-1.27; 18 -10.16,1.27; 19 -7.62,-1.27; 20 -7.62,1.27; 21 -5.08,-1.27; 22 -5.08,1.27; 23 -2.54,-1.27; 24 -2.54,1.27; 25 0,-1.27; 26 0,1.27; 27 2.54,-1.27; 28 2.54,1.27; 29 5.08,-1.27; 30 5.08,1.27; 31 7.62,-1.27; 32 7.62,1.27; 33 10.16,-1.27; 34 10.16,1.27; 35 12.7,-1.27; 36 12.7,1.27; 37 15.24,-1.27; 38 15.24,1.27; 39 17.78,-1.27; 40 17.78,1.27; 41 20.32,-1.27; 42 20.32,1.27; 43 22.86,-1.27; 44 22.86,1.27; 45 25.4,-1.27; 46 25.4,1.27; 47 27.94,-1.27; 48 27.94,1.27; 49 30.48,-1.27; 50 30.48,1.27
ML20L = drill 0.914 octagon: 1 -11.43,-1.27; 2 -11.43,1.27; 3 -8.89,-1.27; 4 -8.89,1.27; 5 -6.35,-1.27; 6 -6.35,1.27; 7 -3.81,-1.27; 8 -3.81,1.27; 9 -1.27,-1.27; 10 -1.27,1.27; 11 1.27,-1.27; 12 1.27,1.27; 13 3.81,-1.27; 14 3.81,1.27; 15 6.35,-1.27; 16 6.35,1.27; 17 8.89,-1.27; 18 8.89,1.27; 19 11.43,-1.27; 20 11.43,1.27
TO92 = drill 0.813 octagon: 1 1.27,0; 2 0,1.905; 3 -1.27,0
TP20SQ = smd 2 x 2: TP 0,0
LQFP-44 = smd 0.2 x 1: 1 -1.98,-4.56; 2 -1.48,-4.56; 3 -0.98,-4.56; 4 -0.48,-4.56; 5 0.02,-4.56; 6 0.52,-4.56; 7 1.02,-4.56; 8 1.52,-4.56; 9 2.02,-4.56; 10 2.52,-4.56; 11 3.02,-4.56; 12 3.52,-4.56; 25 3.52,3.94; 26 3.02,3.94; 27 2.52,3.94; 28 2.02,3.94; 29 1.52,3.94; 30 1.02,3.94; 31 0.52,3.94; 32 0.02,3.94; 33 -0.48,3.94; 34 -0.98,3.94; 35 -1.48,3.94; 36 -1.98,3.94 | smd 1 x 0.2: 13 5.02,-3.06; 14 5.02,-2.56; 15 5.02,-2.06; 16 5.02,-1.56; 17 5.02,-1.06; 18 5.02,-0.56; 19 5.02,-0.06; 20 5.02,0.44; 21 5.02,0.94; 22 5.02,1.44; 23 5.02,1.94; 24 5.02,2.44; 37 -3.48,2.44; 38 -3.48,1.94; 39 -3.48,1.44; 40 -3.48,0.94; 41 -3.48,0.44; 42 -3.48,-0.06; 43 -3.48,-0.56; 44 -3.48,-1.06; 45 -3.48,-1.56; 46 -3.48,-2.06; 47 -3.48,-2.56; 48 -3.48,-3.06
SD_CARD = smd 1 x 1.5: 1 6.875,24.3; 2 4.405,24.3; 3 1.075,24.3; 4 -0.625,24.3; 5 -3.125,24.3; 6 -5.625,24.3; 7 -8.05,24.3; 8 -9.75,24.3; 9 9.375,24.3; CD 2.725,24.3; WP -13.1,24.3 | drill 1.5 square: GND1 -12.1,0; GND2 12.1,0 | smd 1.2 x 2.2: SHIELD1 -14.4,2.1; SHIELD2 14.4,3.3
SNES = drill 1 pad 2.184: 1 -10.776,0; 2 -7.184,0; 3 -3.592,0; 4 3.592,0; 5 7.184,0; 6 10.776,0; 7 14.368,0
FXO_HC73 = smd 1.8 x 2: ENABLE -2.54,-2.1; OUT 2.54,2.1; P$4GND 2.54,-2.1; VDD -2.54,2.1
HDF15H = drill 0.9 octagon: 1 4.329,2.54 | drill 0.9: 2 2.043,2.54; 3 -0.243,2.54; 4 -2.529,2.54; 5 -4.815,2.54; 6 5.472,0; 7 3.186,0; 8 0.9,0; 9 -1.386,0; 10 -3.672,0; 11 4.329,-2.54; 12 2.043,-2.54; 13 -0.243,-2.54; 14 -2.529,-2.54; 15 -4.815,-2.54 | hole 3: -12.5,0; 12.5,0
J1 = drill 0.9 pad 1.3: 1 4.445,2.54; 2 3.175,0; 3 1.905,2.54; 4 0.635,0; 5 -0.635,2.54; 6 -1.905,0; 7 -3.175,2.54; 8 -4.445,0 | drill 1 pad 1.422: 9 5.465,7.37; 10 2.925,7.37; 11 -2.925,7.37; 12 -5.465,7.37 | drill 1.6 pad 2.184: M1 -7.875,-3.3; M2 7.875,-3.3 | hole 3.3: 5.715,-6.35; -5.715,-6.35

### Placement (x,y rotation side)
C1  47,82 0 top
C2  46.5,91 0 top
C3  77,89 0 top
C4  36.59,48.52 90 top
C5  58,76 270 top
C6  56,76 270 top
C7  54,76 270 top
C8  62,74 270 top
C9  66,76 90 top
C10  68,76 90 top
C11  70,76 90 top
C12  30.94,4.52 90 top
C13  79.02,4.52 90 top
LED1  136,4 180 top
LED2  16,4 180 top
LED3  22,4 180 top
LED4  130,4 180 top
LED5  6,77.5 180 top
R1  72,44 90 top
R2  76,44 90 top
R3  80,44 90 top
R4  85,44 90 top
R5  89,44 90 top
R6  93,44 90 top
R7  102,44 90 top
R8  106,44 90 top
R9  75,54 180 top
R10  88,54 180 top
R11  101,54 180 top
R12  52.5,96 270 top
R13  50,96 90 top
R14  40,76 0 top
R15  26.5,76.02 180 top
R16  67,83 0 top
R17  67,81 0 top
R18  67,86 0 top
R19  41,63 0 top
R20  41,59 0 top
R21  41,55 0 top
R22  41,70.86 0 top
R23  41,67 0 top
R24  140,14 90 top
R25  17,13 90 top
R26  20,13 90 top
R27  137,14 90 top
R28  15,77.5 0 top
R29  140.67,63.96 180 top
RN1  47,76 180 top
RN2  46.5,86.5 180 top
S1  14,38 0 top
S2  21,31 0 top
S3  14,24 0 top
S4  7,31 0 top
S5  134,24 0 top
S6  143,38 0 top
SV1  90,14.4 0 top
SV2  90,65.2 0 top
SV3  93,89 0 top
T1  135.79,59.28 0 top
TP1  135,54 90 top
TP2  138,54 90 top
U$1  58.02,86.95 180 top
U$2  6.08,58.94 270 top
U$3  100,3 0 top
U$4  50,3 0 top
U$5  77,82 180 top
X1  129.21,88.74 180 top
X2  33.61,86.22 180 top

### Tracks (layer width: path | path; a pad name or v marks a point on that pad's centre or on a via)
3V  (via drill 0.7)
  Top 0.203: 68,75 66,75 | 68,75 70,75 C11.1 | 68,75 C10.1 | 66,75 65,74 65,66.5 SV2.6 65,66 65,64 SV2.5 | 66,75 C9.1 | v136,56 TP2.TP | U$5.VDD 79.5,80 79.5,84 U$5.ENABLE 79.5,84.5 79.5,88 81.5,88 SV3.1 | 52.5,95 51.5,96 51.5,96.5 50,96.5 R13.2 | 68,81 68,83 R16.2 67.5,83 67,83.5 67,90 | 67,90 77.5,90 77.5,89 C3.2 78,89 | 67,90 U$1.48 61,90 55,90 54,91 54,93.5 52.5,95 | 52.5,95 R12.2 | v28.5,58 30,59.5 U$2.4 | 46,59 46,55 R21.2 | 46,67 46,63 | 46,63 46,59 | 46,59 R20.2 | 46,63 R19.2 | U$1.22 57.5,85.5 58,85 U$1.32 58,79.5 v57,78.5 | 47.5,75 46.5,75 | 47.5,75 48,75 RN1.A2 | 47.5,75 RN1.B2 | 46.5,75 46.5,71 R22.2 46,70.5 46,67 | 46.5,75 RN1.C2 | 46,67 R23.2 | v68,79.5 68,81 | 68,81 R17.2
  Top 0.25: 78,89 78.5,89 79.5,88
  Bottom 0.203: v136,56 132.5,59.5 69,59.5 65,63.5 SV2.5 64.5,63.5 60,59 R20.2 | v28.5,58 36.5,50 C4.2 37,50 42,55 R21.2 | R22.2 46.5,71 47,71.5 50,71.5 v57,78.5 58.5,80 67.5,80 v68,79.5 | SV3.1 81.5,88 81.5,90 SV3.2
5V  (via drill 0.7)
  Top 0.203: S6.1 140,40.5 146,40.5 S6.2 | S5.1 131,26.5 137,26.5 S5.2 | U$3.1 79.5,3 C13.1 | U$4.1 31,3 C12.1 30.5,3.5 18,16 18,19.5 20,21.5 20,23.5 17.5,26 S3.2 17,26.5 14,26.5 | 14,40.5 11,40.5 S1.1 | 14,26.5 11,26.5 S3.1 | SV2.4 62,66 62,64 SV2.3 62,63.5 60,61.5 v60,39 | 19.5,33.5 24,33.5 S2.2 | 19.5,33.5 18,33.5 S2.1 17.5,33.5 14,33.5 | 14,33.5 10.5,33.5 S4.2 | 14,33.5 14,26.5 | 19.5,33.5 19.5,38 17.5,40 S1.2 17,40.5 15,40.5 14,40.5 | R28.2 13,77.5 13,41.5 14,40.5
  Top 0.4: 137,26.5 137,40 137.5,40.5 139.51,40.5 S6.1
  Bottom 0.203: S4.1 4,33.5 10,33.5 S4.2 | v60,39 54.5,33.5 24.5,33.5 S2.2 | C13.1 79,3 77.5,1.5 41,1.5 39.5,3 U$4.1 | U$3.1 89.5,3 94.5,8 131,8 141.5,18.5 141.5,26 137.5,26 S5.2
BLUE  (via drill 0.7)
  Top 0.203: R8.2 106,54 R11.1 | v125,54.5 125,82 129,86 X1.3
  Bottom 0.203: R7.2 102,49 106,49 R8.2 106,49.5 120,49.5 v125,54.5
GND  (via drill 0.6, 0.7)
  Top 0.203: 54,89 54,87 U$1.19 | 54,89 U$1.15 52.5,89 50,89 49.5,88.5 49.5,83.5 48,82 C1.2 | 60,89 U$1.36 U$1.35 59.5,76.5 58,75 | 60,89 60,89.5 61,89.5 U$1.47 62.5,89.5 66,86 R18.1 | 60,89 54,89 | C3.1 76,89 74.5,87.5 v74.5,86 74.5,84.5 U$5.P$4GND 74,84 71,81 | 68,77 66,77 C9.2 66,76.5 64,76.5 64,73.5 C8.- 61.5,71 | 68,77 70,77 | 68,77 C10.2 | 56,75 54,75 C7.2 | 56,75 58,75 | 56,75 C6.2 | 61.5,71 60,69.5 60,66.5 SV2.2 59.5,66 59.5,64 SV2.1 | 58,75 61.5,71.5 61.5,71 | 71,81 70,80 70,77 | 70,77 C11.2 | 58,75 C5.2 | 71,81 v71,80.5 71,55 70,54 R9.2 | 6.5,45 9,45 U$2.SHIELD2 | 6.5,45 6.5,46.5 U$2.GND2 6,47 6,71 U$2.GND1 6.5,71.5 8,73 U$2.SHIELD1 8,73.5 8,74.5 5,77.5 LED5.K | 31.5,59 30.5,58 U$2.3 | 31.5,59 31.5,63.5 30.5,64.5 U$2.6 30.5,65 32,66.5 32,74 | 31.5,59 33,57.5 33,51 36.5,47.5 C4.1 | 34.5,84.5 34.5,84 X2.5 34,83.5 34,76 32,74 | 34.5,84.5 34.5,85 40.5,85 43.5,88 43.5,92 46.5,92 47,91.5 47,91 C2.2 | 32,74 30.5,72.5 U$2.WP | 34.5,84.5 33,86 X2.4 | X1.10 133,88.5 134,87.5 134,86.5 X1.5 | X1.6 124,89 126,89 X1.7 126.5,89 128,89 X1.8 | SV2.50 120.5,66 120.5,64 SV2.49 120.5,63.5 v120.5,44.5 120.5,16 SV1.50 120.5,15.5 120.5,13.5 SV1.49 | SV1.49 120,13 114.5,7.5 114.5,3 U$3.7 | LED4.K 128.5,4 120.5,12 120.5,13 SV1.49 | SV1.23 87,13.5 79.5,6 C13.2 79,6 64.5,6 | SV1.1 59.5,13.5 59.5,15.5 SV1.2 | 64.5,6 64.5,3 U$4.7 | 64.5,6 64.5,13 SV1.5 | 6.5,45 6,44.5 v6,40 v6,21.5 6,12.5 14.5,4 LED2.K
  Bottom 0.203: 81.5,55 71,55 70,54 R9.2 69.5,54 63,47.5 37,47.5 C4.1 36.5,47 6.5,47 U$2.GND2 | 81.5,55 82.5,54 R10.2 | 81.5,55 94.5,55 95.5,54 R11.2 | X1.10 132.5,89 131.5,90 129.5,90 128.5,89 X1.8 | 134,66 120.5,66 SV2.50 | 134,66 137,66 137,59.5 T1.1 | 134,66 134,86 X1.5 | 19.5,5 16,5 15,4 LED2.K | 19.5,5 20.5,4 LED3.K | 19.5,5 30,5 30.5,5.5 C12.2 31,5.5 32,4.5 62.5,4.5 64,3 U$4.7 | SV1.1 60,13 61,12 63.5,12 64.5,13 SV1.5 | SV1.49 120,13 118.5,11.5 89,11.5 87.5,13 SV1.23 | SV3.4 84,90 84,88 SV3.3 84,87.5 82.5,86 v74.5,86 | LED1.K 134.5,4 133,2.5 130.5,2.5 129,4 LED4.K
  other vias: 15.5,96 18,87.5 3.5,83.5 9,64 9,56.5 11,12.5 25.5,16.5 24,24 31.5,27 39.5,14.5 49.5,13.5 44.5,14.5 51,19.5 57,22.5 31,31.5 44.5,31 48,31 56.5,31.5 56.5,44.5 50,45 50,49.5 56,51 66,58.5 35.5,90 71.5,87 76.5,83 92,77 115.5,77 129.5,77 146,77.5 118,58 99.5,58 97.5,44.5 129.5,35 123.5,28.5 145.5,26.5 146,11 123,3.5 86,5.5 71.5,3.5
  pour Top (isolate 0.61): 149,99 1,99 1,1 149,1
  pour Bottom (isolate 0.61): 149,99 1,99 1,1 149,1
GREEN  (via drill 0.7)
  Top 0.203: R6.2 93,54 R10.1 | v123,54.5 123,82 127,86 X1.2
  Bottom 0.203: 89,49 85,49 R4.2 | 89,49 93,49 R6.2 93,49.5 95,51.5 120,51.5 v123,54.5 | 89,49 R5.2
N$1  (via drill 0.7)
  Top 0.203: 45,82.5 45,85.5 RN2.D2 | 45,82.5 45,80.5 50,80.5 51.5,82 51.5,88 52.5,88 U$1.17 | 45,82.5 v44.5,82.5
  Bottom 0.203: v44.5,82.5 30.5,82.5 29.5,83.5 X2.1
N$2  (via drill 0.7)
  Top 0.203: v50.5,87.5 50.5,88.5 52.5,88.5 U$1.16 | v46,84 46,85.5 RN2.C2
  Bottom 0.203: 48.5,87.5 31.5,87.5 30.5,86.5 X2.2 | 48.5,87.5 v50.5,87.5 | v46,84 47,83 48,83 48.5,83.5 48.5,87.5
N$3  (via drill 0.7)
  Top 0.203: 47,86.5 48.5,86.5 48.5,89.5 52.5,89.5 U$1.14 | 47,86.5 47,86 RN2.B2 | v43.5,85 44.5,86 44.5,86.5 47,86.5
  Bottom 0.203: v43.5,85 38,85 37,84 X2.7
N$4  (via drill 0.7)
  Top 0.203: U$1.13 52.5,90 48.5,90 48.5,91.5 47.5,92.5 43,92.5 43,88.5 41,86.5 38.5,86.5 X2.8 | v47.5,84 47.5,85.5 RN2.A2
  Bottom 0.203: v47.5,84 45.5,86 38.5,86 X2.8
N$5  (via drill 0.7)
  Top 0.203: v56,80.5 U$1.28 | v48.5,79.5 48.5,77 RN1.A1
  Bottom 0.203: 48.5,80.5 32.5,80.5 29.8,80.5 X2.9 | 48.5,80.5 v56,80.5 | 48.5,80.5 v48.5,79.5
N$6  (via drill 0.7)
  Top 0.203: v55,84.5 U$1.26 | v52.5,83.5 52,83 52,79 49,76 46.5,76 | 46.5,76 46.5,76.5 RN1.C1 | 46.5,76 45,76 45,75 38.5,75 38,75.5 38,77.78 X2.12
  Bottom 0.203: v55,84.5 54,83.5 v52.5,83.5
N$7  (via drill 0.7)
  Top 0.203: U$1.27 55.5,82 v55,81.5 | v44.5,77.5 45,78 47.5,78 47.5,77 RN1.B1
  Bottom 0.203: v55,81.5 54,82.5 52,82.5 51.5,83 51.5,88.5 43,88.5 42.5,88 30.5,88 27,84.5 27,77.5 v44.5,77.5
N$8  (via drill 0.7)
  Top 0.203: v56,87 56,86 U$1.21 | v56,93.5 52.5,97 R12.1
  Bottom 0.203: v56,93.5 v56,87
N$9  (via drill 0.7)
  Top 0.203: v55,88 55,86.5 U$1.20 | R13.1 v50,93
  Bottom 0.203: v50,93 v55,88
N$10  (via drill 0.7)
  Top 0.203: R15.2 26,76.5 27,77.5 27,79.5 31.5,84 X2.3 | 47,87.5 47.5,87.5 RN2.A1 | 46,87.5 45.5,87.5 RN2.D1 45,87.5 44.5,88 | 44.5,88 45.5,89 45.5,91 C2.1 | 44.5,88 42.5,86 v42.5,81.5 42.5,77.5 41,76 R14.2 | v49.5,81.5 49.5,81 47,81 46.5,81.5 46.5,82 C1.1 | 46,87.5 47,87.5 | 47,87.5 RN2.B1 | 46,87.5 RN2.C1
  Bottom 0.203: X2.6 35.5,86 34.5,85 33,85 32,84 X2.3 31.5,84 30.5,85 29,85 28,84 28,81.5 v42.5,81.5 v49.5,81.5
N$11
  Top 0.203: U$1.39 64.5,85.5 64.5,82.5 66,81 R17.1
N$12
  Top 0.203: R15.1 27.5,76.5 28.34,76.5 X2.10
N$13
  Top 0.203: 39.5,76 R14.1 39.15,76.15 41,78 41,80 40.5,80.5 37.5,80.5 36.5,79.5 36.5,78.89 X2.11
N$14
  Top 0.203: R24.1 140,6.5 137.5,4 LED1.A
N$15
  Top 0.203: R25.1 17,4 LED2.A
N$16
  Top 0.203: R26.1 20,7.5 23,4.5 23,4 LED3.A
N$17
  Bottom 0.203: LED4.A 131.5,4 136,8.5 137,8.5 R27.1
N$18
  Top 0.203: R28.1 LED5.A
N$19
  Top 0.203: T1.2 136,61.5 136,63.5 R29.2
N$20
  Top 0.203: TP1.TP 135,59 T1.3
N$23  (via drill 0.7)
  Top 0.203: v53,79.5 53.5,80 53.5,84 U$1.24 | v69.5,83.5 68,85 68,86 R18.2
  Bottom 0.203: v53,79.5 57,79.5 61,83.5 v69.5,83.5
N$24  (via drill 0.7)
  Top 0.203: C8.+ 62,78.5 | 62,78.5 62,84 U$1.37 | 54,77 54,85 U$1.23 52.5,85 52,85.5 52,87.5 52.5,87.5 U$1.18 | 54,77 56,77 | 54,77 C7.1 | 56,77 58,77 | 56,77 C6.1 | v61,78.5 62,78.5 | v58.5,78.5 58,78 58,77 | 58,77 C5.1
  Bottom 0.203: v58.5,78.5 v61,78.5
N$61  (via drill 0.6)
  other vias: 86,36.5
PA1  (via drill 0.7)
  Top 0.203: v59,84.5 U$1.34 | 73.5,81 74,80.5 74,80 U$5.OUT | 73.5,81 v73,81.5 | v71,48 71,14.5 72,13.5 SV1.11 | v71.5,54 73.5,56 73.5,81
  Bottom 0.203: v59,84.5 62.5,88 66.5,88 v73,81.5 | v71,48 71,54 v71.5,54
PA2  (via drill 0.7)
  Top 0.203: v57,84.5 U$1.30 | v76.5,79.5 86,70 86,61.5 75,50.5 75,16 SV1.14
  Bottom 0.203: v57,84.5 61,88.5 67.5,88.5 v76.5,79.5 78.5,79.5 86.5,87.5 SV3.5
PA7  (via drill 0.7)
  Top 0.203: U$1.40 65,86 65,84 66,83 R16.1 66.5,83 67,82.5 v67,78.5 | v91.5,71 91.5,63.5 88,60 88,48.5 79,39.5 79,38.5 79.5,38 79.5,27.5 78.5,26.5 78.5,14.5 79.5,13.5 SV1.17
  Bottom 0.203: 89,73.5 84,78.5 v67,78.5 | 89,73.5 v91.5,71 | 89,73.5 108,73.5 108,91 106,93 92,93 89.5,90.5 SV3.8
PB0
  Top 0.203: S6.4 146,36 140,36 S6.3
  Bottom 0.203: SV1.22 85,16 85,31.5 135.5,31.5 139.5,35.5 S6.3
PB1
  Top 0.203: S5.4 137,22 131,22 S5.3
  Bottom 0.203: SV1.21 85,13.5 86,14.5 86,21.5 130.5,21.5 S5.3
PB2  (via drill 0.7)
  Top 0.203: v42,24.5 28.5,38 28.5,54.5 30,56 U$2.CD
  Bottom 0.203: v42,24.5 55,11.5 85,11.5 86,12.5 86,13.5 87,14.5 87,15.5 SV1.24
PB4  (via drill 0.7)
  Top 0.203: v78,31.5 78,39.5 84,45.5 84,57.5 90,63.5 SV2.25 | S2.3 18,29 24,29 S2.4
  Bottom 0.203: v78,31.5 75.5,29 24.5,29 S2.4
PB5  (via drill 0.7)
  Top 0.203: v77,29 77,39.5 81.5,44 81.5,56 88.5,63 88.5,64.5 90,66 SV2.26 | S3.3 11,22 17,22 S3.4
  Bottom 0.203: v77,29 73.5,25.5 21,25.5 17.5,22 S3.4
PB7  (via drill 0.7)
  Top 0.203: v90,48 90,52.5 94,56.5 94,72 91,72 90.5,71.5 90.5,69.5 87.5,66.5 SV2.24 | S1.3 11,36 17,36 S1.4
  Bottom 0.203: v90,48 83,41 22.5,41 17.5,36 S1.4
PB8  (via drill 0.7)
  Top 0.203: v64.5,45.5 72.5,53.5 72.5,54 82,63.5 SV2.19
  Bottom 0.203: v64.5,45.5 61.5,42.5 22,42.5 16.5,37 16,37 12.5,33.5 12.5,29 10.5,29 S4.4 10,29 4,29 S4.3
PB11  (via drill 0.7)
  Top 0.203: U$1.2 59.5,92.5 64,92.5 65.5,92 87,92 88,91 88,85 90,83 99,83 v105.5,76.5 106.5,75.5 106.5,59 v107,58.5 | v103,57 102.5,56.5 102.5,50 103,49.5 103,17.5 101.5,16 101.5,14.5 102.5,13.5 SV1.35
  Bottom 0.203: v107,58.5 105.5,57 v103,57 | SV3.11 98,84 104,84 105.5,82.5 v105.5,76.5
PB12  (via drill 0.7)
  Top 0.203: U$1.3 59,93 64.5,93 66,92.5 89.5,92.5 90.5,91.5 90.5,84 91,83.5 100.5,83.5 107.5,76.5 109,75 v109,17.5
  Top 0.25: SV3.12 94.27,91.23 93,92.5 89.5,92.5
  Bottom 0.203: v109,17.5 109,14.5 104,14.5 103,15.5 SV1.36
PB13  (via drill 0.7)
  Top 0.203: U$1.4 58.5,91 59,90.5 62.5,90.5 62.5,92 63.5,92 65,91.5 85,91.5 85.5,91 85.5,86.5 89.5,82.5 94,82.5 v101.5,75 101.5,61 105.5,57 v105.5,56 | v103.5,54 104,53.5 104,14.5 105,13.5 SV1.37
  Bottom 0.203: v103.5,54 v105.5,56 | v101.5,75 107,75 107,82.5 104.5,85 99.5,85 97,87.5 SV3.13
PC1  (via drill 0.7)
  Top 0.203: U$1.31 57.5,80.5 v55,78 | v52.5,75.5 53,75 53,62.5 59,56.5 59,18 61,16 61,12.5 61.5,12 63.5,12 63.5,13.5 64.5,14.5 67,14.5 67,13.5 SV1.7
  Bottom 0.203: v52.5,75.5 53,76 | 53,76 v55,78 | 53,76 26,76 26,85 36.5,95.5 81.5,95.5 86.5,90.5 SV3.6
PC4  (via drill 0.6, 0.7)
  Top 0.203: v60,74.5 60,79 60.5,79.5 60.5,87.5 61,87.5 U$1.43 | v64,71 64,67.5 63.5,67 63.5,43 61.5,41 v61.5,24.5 | v86.5,74 v86.5,82.5
  Bottom 0.203: v60,74.5 63.5,71 v64,71 83.5,71 v86.5,74 | v61.5,24.5 69,17 81,17 82,16 SV1.20
  Bottom 0.25: v86.5,82.5 SV3.9
PC5  (via drill 0.7)
  Top 0.203: v63,87 63,88 U$1.44 | v63,79 v63,84.5 | v52,71 52.5,70.5 v52.5,21 | v106,91 106,85 v103.5,82.5 | v81,77 v84,80
  Bottom 0.203: v63,84.5 v63,87 | 61,77 55,71 v52,71 | 61,77 v63,79 | v52.5,21 59,14.5 81,14.5 82,13.5 SV1.19 | v106,91 105,92 93.5,92 92,90.5 SV3.10 | v103.5,82.5 101,80 v84,80 | 61,77 v81,77
PC8  (via drill 0.7)
  Top 0.203: v29,66 29,66.5 30,66.5 U$2.7
  Bottom 0.203: 30,67 v29,66 | R23.1 30,67 | 30,67 27,67 27,68.5 30.5,72 36.5,72 39,69.5 109,69.5 109,66 110,65 114,65 115,64 SV2.45
PC9  (via drill 0.7)
  Top 0.203: v31,70 31,69.5 30.5,69 U$2.8 | v50.5,70.5 47.5,67.5 47.5,55 46.5,54 37.5,54 37.5,69 36,70.5 R22.1
  Bottom 0.203: v31,70 31.5,70.5 35.5,70.5 R22.1 | v50.5,70.5 51,70 111.5,70 115,66.5 SV2.46
PC10
  Top 0.203: U$2.9 30.5,49.5 34,46 38,46 38,51.5 36,53.5 36,55 R21.1
  Bottom 0.203: SV2.37 105,64 104,65 90,65 88.5,66.5 88.5,67.5 48.5,67.5 36,55 R21.1
PC11
  Top 0.203: U$2.1 30,52 29,51 29,49 32.5,45.5 38.5,45.5 38.5,52 37,53.5 37,58 36,59 R20.1
  Bottom 0.203: SV2.38 105,66.5 103,68.5 39,68.5 34,63.5 31.5,63.5 31,63 31,56.5 31.5,56 32.5,56 35.5,59 R20.1
PC12  (via drill 0.7)
  Top 0.203: v28,68 28,64.5 30,62.5 U$2.5
  Bottom 0.203: v28,68 29,69 104.5,69 106.5,67 106.5,62.5 104,62.5 103,63.5 SV2.35
PD0
  Top 0.203: SV2.36 103,66 104,65 104,59.5 108.5,55 108.5,18.5 108,18 108,17 109,16 109,8 104,3 U$3.4
PD1  (via drill 0.7)
  Top 0.203: v110,61 111.5,59.5 111.5,9.5 105,3 105,2 104.5,1.5 96.5,1.5 96.5,3 U$3.3
  Bottom 0.203: v110,61 103,61 100.5,63.5 SV2.33
PD2  (via drill 0.7)
  Top 0.203: v32,57 32,55 30.5,55 U$2.2
  Bottom 0.203: v32,57 32,63 R19.1 36,63 41,68 98.5,68 100,66.5 SV2.34
PD3
  Top 0.203: SV2.31 98,63.5 104.5,57 104.5,42 107,39.5 107,36 106.5,35.5 106.5,12.5 98.5,4.5 93,4.5 93,3 U$3.2
PD5  (via drill 0.7)
  Top 0.203: v54,60 54,3 U$4.4
  Bottom 0.203: v54,60 59,65 73.5,65 73.5,63.5 74.5,62.5 94,62.5 95,63.5 SV2.29
PD6  (via drill 0.7, 0.7 pad 1.27)
  Top 0.203: v97,50.5 97,54.5 96.5,55 96.5,65 95.5,66 SV2.30 | v51.5,40 46.5,35 46.5,3 U$4.3
  Bottom 0.203: v97,50.5 86.5,40 v51.5,40
PD7  (via drill 0.7)
  Top 0.203: v89,58.5 89,60 92.5,63.5 SV2.27 | v51.5,55.5 43,47 43,3 U$4.2
  Bottom 0.203: v89,58.5 86,55.5 v51.5,55.5
PD8  (via drill 0.7)
  Top 0.203: v107.5,35 107.5,16 SV1.40
  Bottom 0.203: v107.5,35 117,35 145.5,63.5 R29.1
PD12  (via drill 0.7)
  Top 0.203: v115,23.5 113,21.5 113,16 SV1.44
  Bottom 0.203: R24.2 140,23.5 v115,23.5
PD13  (via drill 0.7)
  Top 0.203: v112.5,9.5 115,12 115,13 SV1.45
  Bottom 0.203: v112.5,9.5 25.5,9.5 17,18 R25.2
PD14
  Bottom 0.203: R26.2 20,18 27,11 130.5,11 138,18.5 138,20.5 120,20.5 115.5,16 SV1.46
PD15
  Bottom 0.203: R27.2 137,19 132.5,14.5 119,14.5 118,13.5 SV1.47
PE6
  Bottom 0.203: X1.13 129,91 128,90 123.5,90 119,85.5 119,60 76,60 72.5,63.5 SV2.11
PE7  (via drill 0.7)
  Top 0.203: v116.5,14.5 116.5,66.5 119.5,69.5 119.5,92.5 130.5,92.5 131.5,91.5 X1.14
  Bottom 0.203: v116.5,14.5 116.5,12 91,12 90,13 SV1.25
PE8  (via drill 0.7)
  Top 0.203: v88.5,37.5 90,36 SV1.26
  Bottom 0.203: v88.5,37.5 105,37.5 106,38.5 R8.1
PE9
  Top 0.203: R7.1 102,38.5 96.5,33 96.5,13 95.5,12 93,12 93,13 SV1.27
PE10
  Top 0.203: R6.1 93,16 SV1.28
PE11
  Top 0.203: R5.1 89,38.5 91.5,36 91.5,15 92,14.5 95,14.5 95,13.5 SV1.29
PE12
  Top 0.203: R4.1 85,39 88,42 95,42 95,16 SV1.30
PE13
  Top 0.203: R3.1 80,38.5 88.5,30 88.5,13 90,11.5 97.5,11.5 97.5,13 SV1.31
PE14  (via drill 0.7)
  Top 0.203: v99,34 98,33 98,16 SV1.32
  Bottom 0.203: v99,34 80.5,34 76,38.5 R2.1
PE15  (via drill 0.7)
  Top 0.203: v99,32.5 99,14.5 100,13.5 SV1.33
  Bottom 0.203: v99,32.5 78,32.5 72,38.5 R1.1
RED  (via drill 0.7)
  Top 0.203: R2.2 76,49 80,49 R3.2 80,54 R9.1 | v121.5,58.5 121.5,83 124.5,86 X1.1
  Bottom 0.203: R1.2 72,49 76,49 R2.2 | v121.5,58.5 116,53 81.5,53 80.5,54 R9.1
VDD
  Top 0.203: SV1.3 62,13.5 62,15.5 SV1.4 62.5,16 62.5,41 83.5,62 83.5,65 84.5,66 SV2.22

### Text on the board
tNames: ETHERNET | REV 1.1 | SSTM32 | POWER | VGA | SD CARD | RUMBLE | UP | B | R2R DAC | LEFT | RIGHT | A | DOWN | CHAOS COMPUTER CLUB COLOGNE | SNES 1 | SNES 2 | LED B | LED A
tDocu: No: 61351
bDocu: No: 61351